# Altium project ZettBrettBoard.PrjPcb (part 1 of 2)
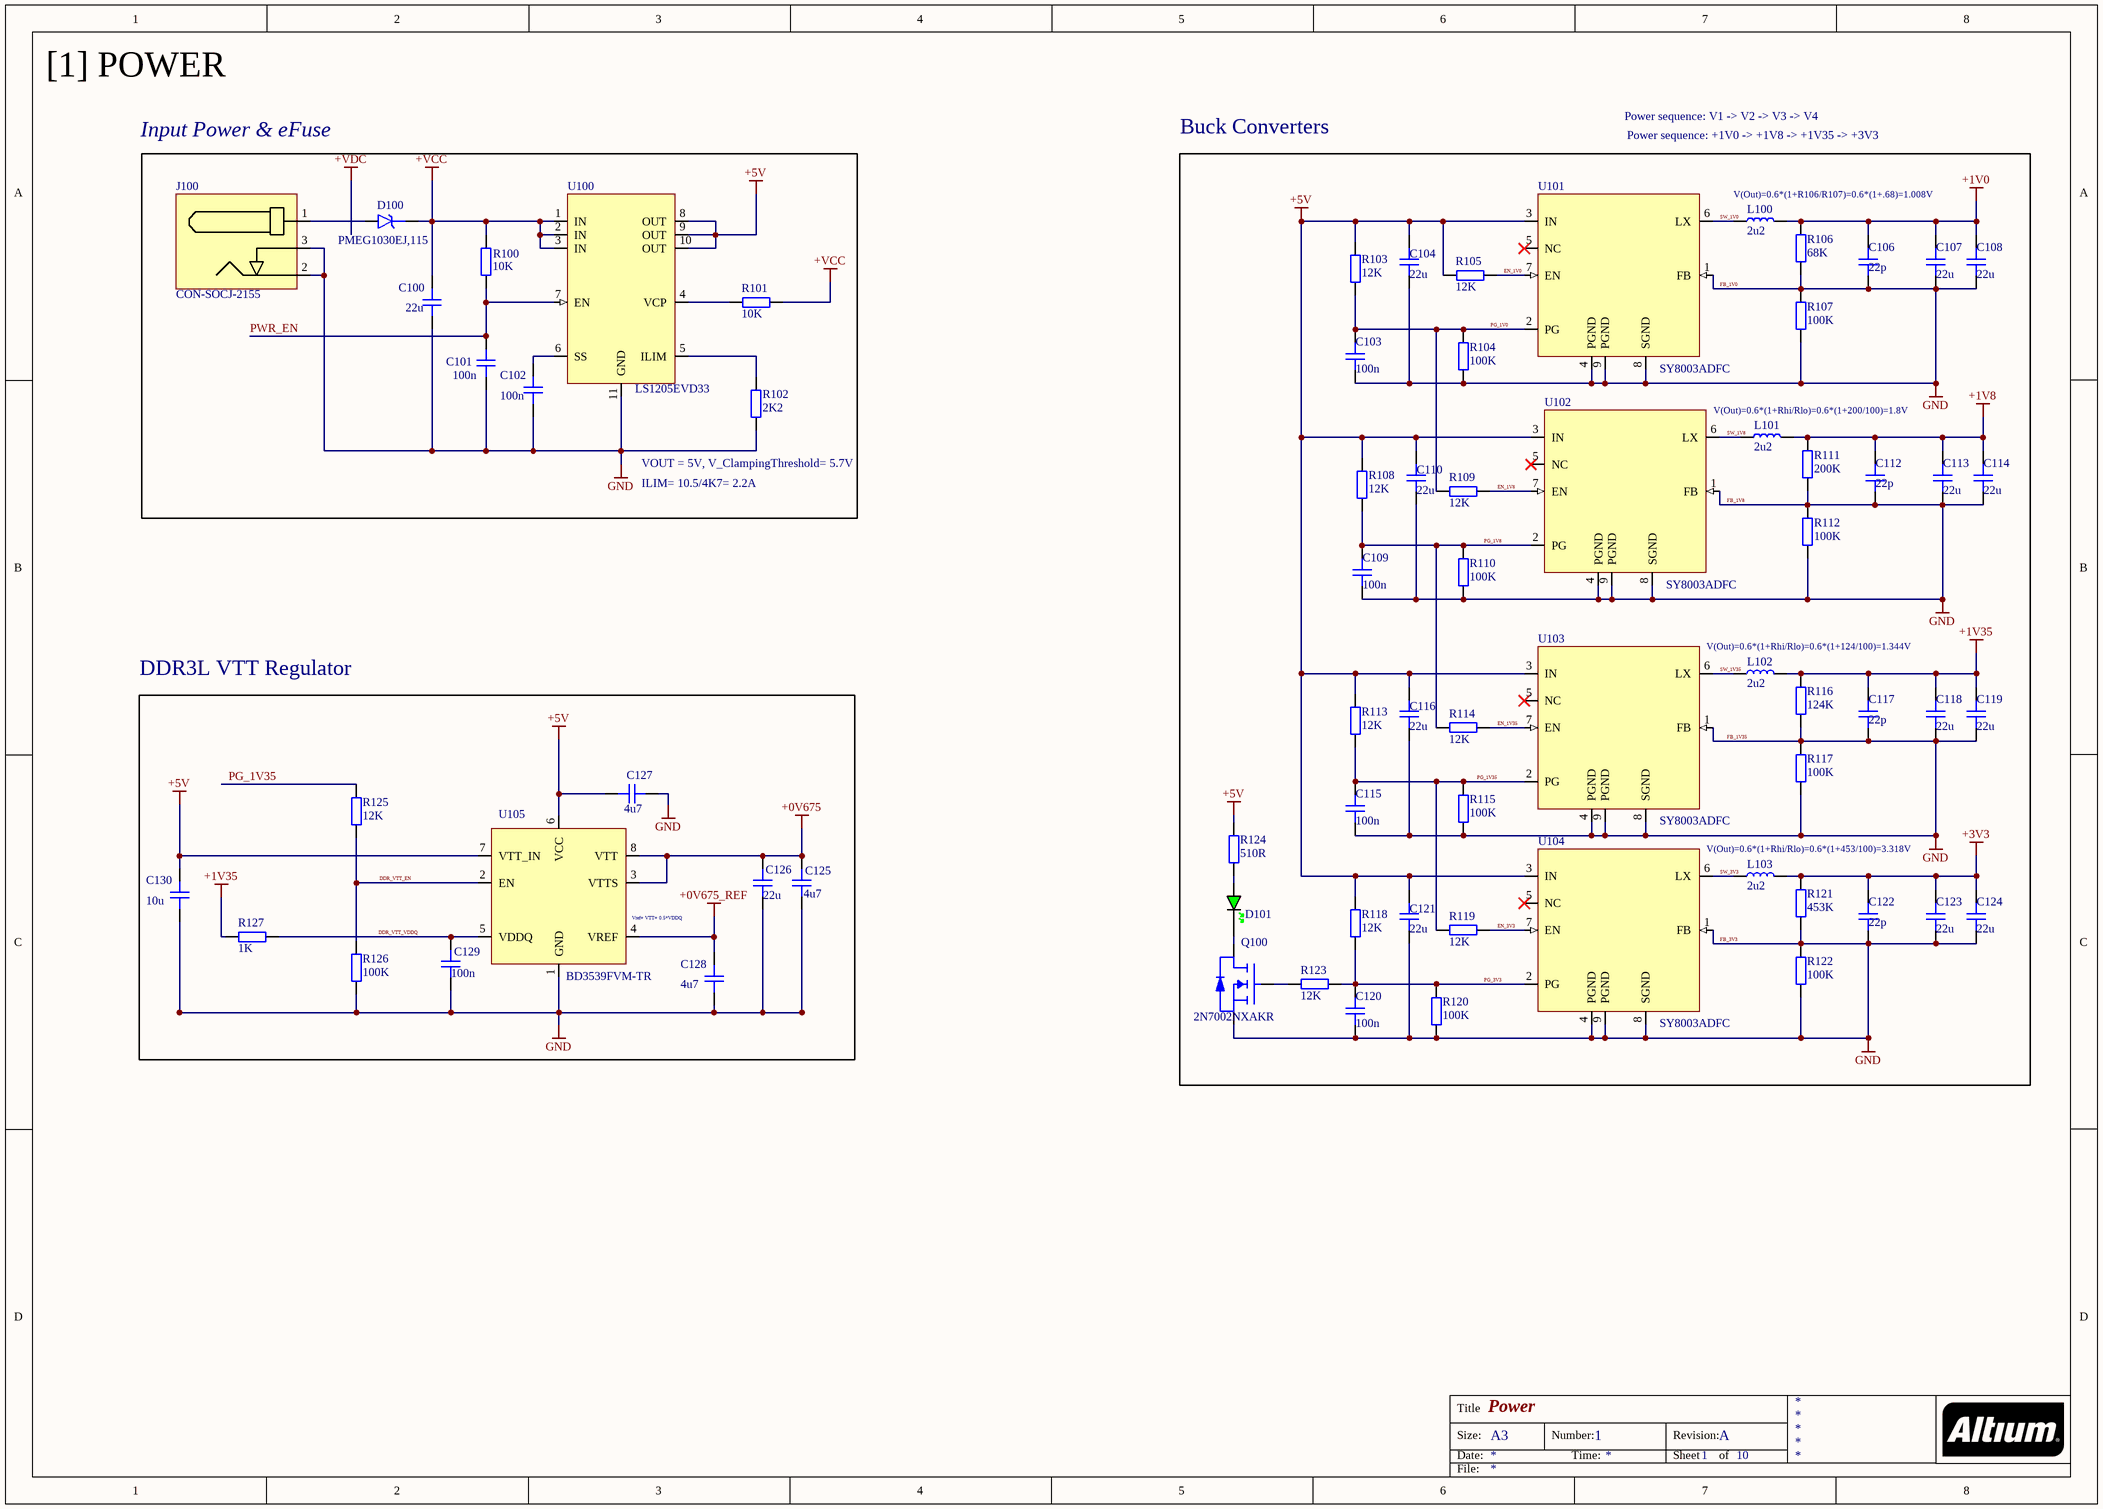
[diagram p0: Power.SchDoc]
10 sheets, 357 parts. Net scope: global (net labels, ports and power ports of the same name join across sheets).
Sheets:
  Power.SchDoc
  Zynq-Power.SchDoc
  Zynq Config - JTAG - Debug.SchDoc
  Zynq Processing System (PS).SchDoc
  Zynq DDR Interface & Termination.SchDoc
  Zynq Programmable Logic System (PL).SchDoc
  Gigabit Ethernet.SchDoc
  USB 2 High Speed (OTG).SchDoc
  DDR3L.SchDoc
  Mezzanine.SchDoc

## Sheet Power.SchDoc: Power
size A3; DocumentNumber: 1; Revision: A; SheetNumber: 1; SheetTotal: 10

### Parts
C100  22u  [CAP_1210]
C101  100n  [CAP_1210]
C102  100n  [CAP_1210]
C103  100n  [CAP_1210]
C104  22u  [CAP_1210]
C106  22p  [CAP_1210]
C107  22u  [CAP_1210]
C108  22u  [CAP_1210]
C109  100n  [CAP_1210]
C110  22u  [CAP_1210]
C112  22p  [CAP_1210]
C113  22u  [CAP_1210]
C114  22u  [CAP_1210]
C115  100n  [CAP_1210]
C116  22u  [CAP_1210]
C117  22p  [CAP_1210]
C118  22u  [CAP_1210]
C119  22u  [CAP_1210]
C120  100n  [CAP_1210]
C121  22u  [CAP_1210]
C122  22p  [CAP_1210]
C123  22u  [CAP_1210]
C124  22u  [CAP_1210]
C125  4u7  [CAP_1210]
C126  22u  [CAP_1210]
C127  4u7  [CAP_1210]
C128  4u7  [CAP_1210]
C129  100n  [CAP_1210]
C130  10u  [CAP_1210]
D100  PMEG1030EJ,115  [SOD-323]
D101  GREEN  [LED_0402_GREEN]  (value not drawn)
J100  CON-SOCJ-2155  [CON-SOCJ-2155]
L100  2u2  [NRS5020]
L101  2u2  [NRS5020]
L102  2u2  [NRS5020]
L103  2u2  [NRS5020]
Q100  2N7002NXAKR  [SSM3J338R,LF-SOT23-F]
R100  10K  [RES_0402]
R101  10K  [RES_0402]
R102  2K2  [RES_0402]
R103  12K  [RES_0402]
R104  100K  [RES_0402]
R105  12K  [RES_0402]
R106  68K  [RES_0402]
R107  100K  [RES_0402]
R108  12K  [RES_0402]
R109  12K  [RES_0402]
R110  100K  [RES_0402]
R111  200K  [RES_0402]
R112  100K  [RES_0402]
R113  12K  [RES_0402]
R114  12K  [RES_0402]
R115  100K  [RES_0402]
R116  124K  [RES_0402]
R117  100K  [RES_0402]
R118  12K  [RES_0402]
R119  12K  [RES_0402]
R120  100K  [RES_0402]
R121  453K  [RES_0402]
R122  100K  [RES_0402]
R123  12K  [RES_0402]
R124  510R  [RES_0402]
R125  12K  [RES_0402]
R126  100K  [RES_0402]
R127  1K  [RES_0402]
U100  LS1205EVD33  [DFN3x3_10L]
U101  SY8003ADFC  [DFN2x2-8]
U102  SY8003ADFC  [DFN2x2-8]
U103  SY8003ADFC  [DFN2x2-8]
U104  SY8003ADFC  [DFN2x2-8]
U105  BD3539FVM-TR  [MSOP8]

### Blocks framed on the sheet
Input Power & eFuse: C100-C102 D100 J100 R100-R102 U100
Buck Converters: C103 C104 C106-C110 C112-C124 D101 L100-L103 Q100 R103-R124 U101-U104
DDR3L VTT Regulator: C125-C130 R125-R127 U105

### Nets
+0V675: C125.2 C126.2 U105.3(VTTS) U105.8(VTT)
+0V675_REF: C128.2 U105.4(VREF)
+1V0: C106.2 C107.2 C108.2 L100.2 R106.1
+1V8: C112.2 C113.2 C114.2 L101.2 R111.1
+1V35: C117.2 C118.2 C119.2 L102.2 R116.1 R127.1
+3V3: C122.2 C123.2 C124.2 L103.2 R121.1
+5V: C104.2 C110.2 C116.2 C121.2 C127.2 C130.2 R103.1 R105.1 R108.1 R113.1 R118.1 R124.2 U100.8(OUT) U100.9(OUT) U100.10(OUT) U101.3(IN) U102.3(IN) U103.3(IN) U104.3(IN) U105.6(VCC) U105.7(VTT_IN)
+VCC: C100.2 D100.K R100.2 R101.1 U100.1(IN) U100.2(IN) U100.3(IN)
FB_1V0: C100.1 C101.1 C102.1 C103.1 C104.1 C106.1 C107.1 C108.1 C109.1 C110.1 C112.1 C113.1 C114.1 C115.1 C116.1 C117.1 C118.1 C119.1 C120.1 C121.1 C122.1 C123.1 C124.1 C125.1 C126.1 C127.1 C128.1 C129.1 C130.1 J100.2 J100.3 Q100.S R102.2 R104.2 R106.2 R107.1 R107.2 R110.2 R111.2 R112.1 R112.2 R115.2 R116.2 R117.1 R117.2 R120.2 R121.2 R122.1 R122.2 R126.2 U100.11(GND) U101.1(FB) U101.4(PGND) U101.8(SGND) U101.9(PGND) U102.1(FB) U102.4(PGND) U102.8(SGND) U102.9(PGND) U103.1(FB) U103.4(PGND) U103.8(SGND) U103.9(PGND) U104.1(FB) U104.4(PGND) U104.8(SGND) U104.9(PGND) U105.1(GND)  [also labelled FB_1V35, FB_1V8, FB_3V3, GND]
DDR_VTT_EN: R125.2 R126.1 U105.2(EN)
DDR_VTT_VDDQ: C129.2 R127.2 U105.5(VDDQ)
EN_1V0: R105.2 U101.7(EN)
EN_1V8: R109.2 U102.7(EN)
EN_1V35: R114.2 U103.7(EN)
EN_3V3: R119.2 U104.7(EN)
PG_1V0: C103.2 R103.2 R104.1 R109.1 U101.2(PG)
PG_1V8: C109.2 R108.2 R110.1 R114.1 U102.2(PG)
PG_1V35: C115.2 R113.2 R115.1 R119.1 R125.1 U103.2(PG)
PG_3V3: C120.2 R118.2 R120.1 R123.2 U104.2(PG)
PWR_EN: C101.2 R100.1 U100.7(EN)
SW_1V0: L100.1 U101.6(LX)
SW_1V8: L101.1 U102.6(LX)
SW_1V35: L102.1 U103.6(LX)
SW_3V3: L103.1 U104.6(LX)
NetC102_2: C102.2 U100.6(SS)
NetD100_A: D100.A J100.1
NetD101_A: D101.A R124.1
NetD101_K: D101.K Q100.D
NetQ100_G: Q100.G R123.1
NetR101_2: R101.2 U100.4(VCP)
NetR102_1: R102.1 U100.5(ILIM)

Not connected (* = marked no-connect by the designer): U101 5(NC)*; U102 5(NC)*; U103 5(NC)*; U104 5(NC)*

### Notes on the sheet
- [1] POWER
- Power sequence: V1 -> V2 -> V3 -> V4
- Power sequence: +1V0 -> +1V8 -> +1V35 -> +3V3
- V(Out)=0.6*(1+R106/R107)=0.6*(1+.68)=1.008V
- V(Out)=0.6*(1+Rhi/Rlo)=0.6*(1+200/100)=1.8V
- ILIM= 10.5/4K7= 2.2A
- (near R102) VOUT = 5V, V_ClampingThreshold= 5.7V
- V(Out)=0.6*(1+Rhi/Rlo)=0.6*(1+124/100)=1.344V
- V(Out)=0.6*(1+Rhi/Rlo)=0.6*(1+453/100)=3.318V
- (near U105) Vref= VTT= 0.5*VDDQ
- Title
- Size:
- Date:
- A3
- Number:
- Time:
- Revision:
- Sheet
- of
- File:

### Library data of the parts
C100-C104 C106-C110 C112-C130 = CAP_1210: Capacitor SMD 1210; Manufacturer: *; Manufacturer Part Number: *; Distributor Link: *; LCSC: *; Rating: *; Dielectric: *
D100 = D_ZENER_SOD_323: Diode Zener SMD SOD-323
D101 = LED_0402_GREEN: LED 0402 GREEN SMD
J100 = CON-SOCJ-2155: DC Barrell Jack 2.1mm 30V 2.5A THT; Manufacturer: Gravitech; Manufacturer Part Number: CON-SOCJ-2155
L100-L103 = NRS5020: NRS5020 SMD Power Inductor Taiyo Yuden; Manufacturer: Taiyo Yuden; Manufacturer Part Number: NRS5020
Q100 = 2N7002NXAKR: MOSFET N-Channel Vds=60V Id=300mA with ESD Protection; Manufacturer: Nexperia; Manufacturer Part Number: 2N7002NXAKR
R100-R127 = RES_0402: Resistor SMD 0402; Manufacturer: *; Manufacturer Part Number: *; Distributor Link: *; LCSC: *
U100 = LS1205EVD33: 18V, 5A eFuse with Programmable Current Limit and Output Voltage Clamp; Manufacturer: Littelfuse; Manufacturer Part Number: LS1205EVD33
U101-U104 = SY8003ADFC: High Efficiency 5.5V, 3A Continuous, 1MHz Synchronous Step Down Regulator; Manufacturer: Silergy; Manufacturer Part Number: High Efficiency 5.5V, 3A continuous, 1MHz; LCSC: C178236
U105 = BD3539FVM-TR: 1.0V to 5.5V, 1A 1Ch Termination Regulator for DDR-SDRAMs; Manufacturer: ROHM Semiconductor; Manufacturer Part Number: BD3539FVM-TR

## Sheet Zynq-Power.SchDoc: Zynq-Power
size A4; DrawnBy: Omar Moussa; Engineer: Omar Moussa; DocumentNumber: 2; Revision: A; SheetNumber: 2; SheetTotal: 10
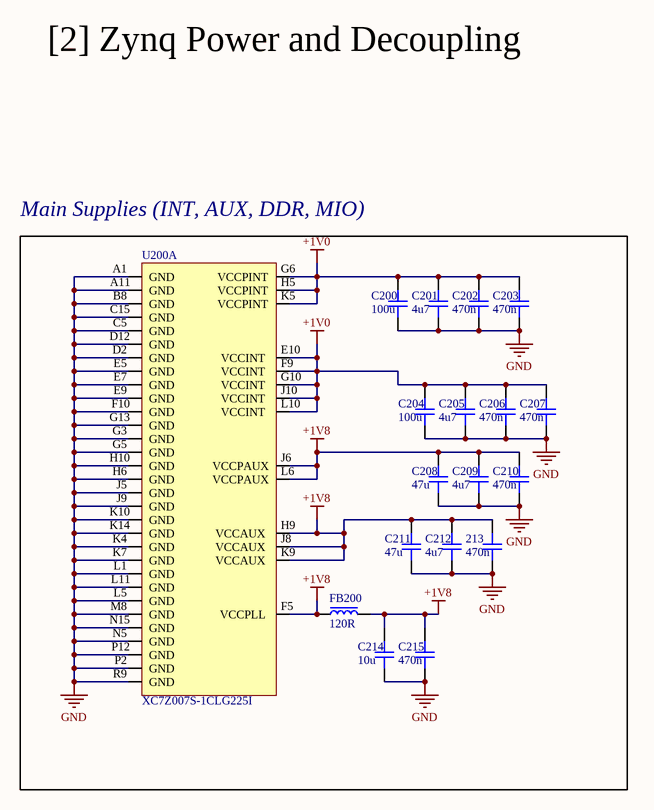
[diagram p1: Zynq-Power.SchDoc]

### Parts
213  470n  [CAP_1210]
C200  100u  [CAP_1210]
C201  4u7  [CAP_1210]
C202  470n  [CAP_1210]
C203  470n  [CAP_1210]
C204  100u  [CAP_1210]
C205  4u7  [CAP_1210]
C206  470n  [CAP_1210]
C207  470n  [CAP_1210]
C208  47u  [CAP_1210]
C209  4u7  [CAP_1210]
C210  470n  [CAP_1210]
C211  47u  [CAP_1210]
C212  4u7  [CAP_1210]
C214  10u  [CAP_1210]
C215  470n  [CAP_1210]
FB200  120R  [FB_0402]
U200  XC7Z007S-1CLG225I  [CLG225]  (part A of 7)

### Blocks framed on the sheet
Main Supplies (INT, AUX, DDR, MIO): 213 C200-C212 C214 C215 FB200 U200

### Nets
+1V0: C200.2 C201.2 C202.2 C203.2 C204.2 C205.2 C206.2 C207.2 U200.E10(VCCINT) U200.F9(VCCINT) U200.G6(VCCPINT) U200.G10(VCCINT) U200.H5(VCCPINT) U200.J10(VCCINT) U200.K5(VCCPINT) U200.L10(VCCINT)
+1V8: 213.2 C208.2 C209.2 C210.2 C211.2 C212.2 C214.2 C215.2 FB200.1 FB200.2 U200.F5(VCCPLL) U200.H9(VCCAUX) U200.J6(VCCPAUX) U200.J8(VCCAUX) U200.K9(VCCAUX) U200.L6(VCCPAUX)
GND: 213.1 C200.1 C201.1 C202.1 C203.1 C204.1 C205.1 C206.1 C207.1 C208.1 C209.1 C210.1 C211.1 C212.1 C214.1 C215.1 U200.A1(GND) U200.A11(GND) U200.B8(GND) U200.C5(GND) U200.C15(GND) U200.D2(GND) U200.D12(GND) U200.E5(GND) U200.E7(GND) U200.E9(GND) U200.F10(GND) U200.G3(GND) U200.G5(GND) U200.G13(GND) U200.H6(GND) U200.H10(GND) U200.J5(GND) U200.J9(GND) U200.K4(GND) U200.K7(GND) U200.K10(GND) U200.K14(GND) U200.L1(GND) U200.L5(GND) U200.L11(GND) U200.M8(GND) U200.N5(GND) U200.N15(GND) U200.P2(GND) U200.P12(GND) U200.R9(GND)  [project net FB_1V0]

### Notes on the sheet
- [2] Zynq Power and Decoupling
- Title
- Size:
- Date:
- A4
- Number:
- Time:
- Revision:
- Sheet
- of
- File:

### Library data of the parts
213 C200-C212 C214 C215 = CAP_1210: Capacitor SMD 1210; Manufacturer: *; Manufacturer Part Number: *; Distributor Link: *; LCSC: *; Rating: *; Dielectric: *
FB200 = FB_0402: Ferrite Bead SMD 0402; Manufacturer: *; Manufacturer Part Number: *; Distributor Link: *; LCSC: *
U200 = XC7Z007S-1CLG225I: Xilinx FPGA SoC Zynq 7-Series XC7Z007S CLG255 Package Industrial Temperature Grade; Manufacturer: Xilinx; Manufacturer Part Number: XC7Z007S-1CLG225I

## Sheet Zynq Config - JTAG - Debug.SchDoc: Zynq (Config, JTAG, Debug)
size A2; DocumentNumber: 3; Revision: A; SheetNumber: 3; SheetTotal: 10
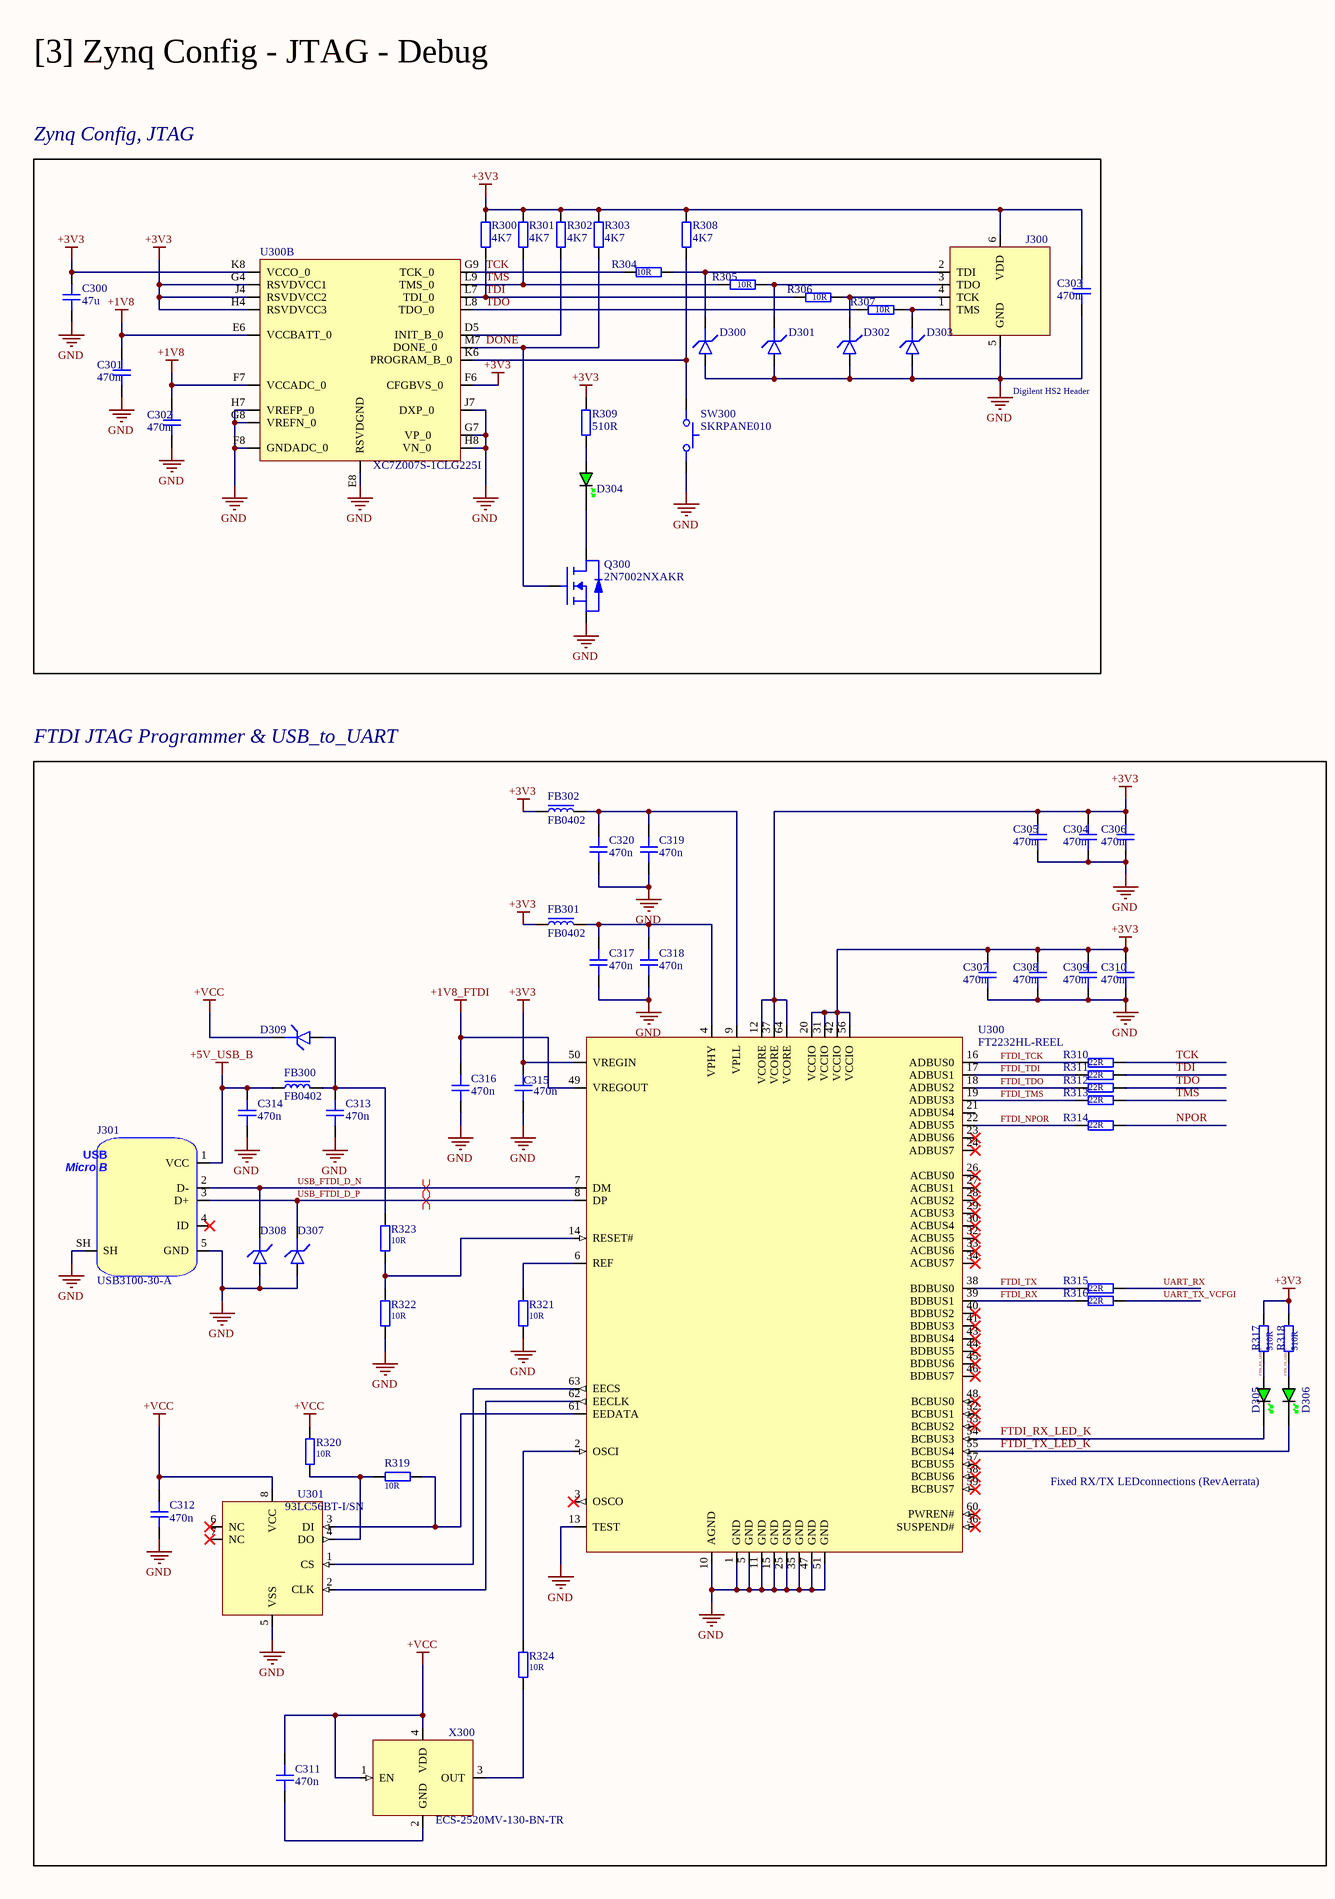
[diagram p2: Zynq Config - JTAG - Debug.SchDoc, left]
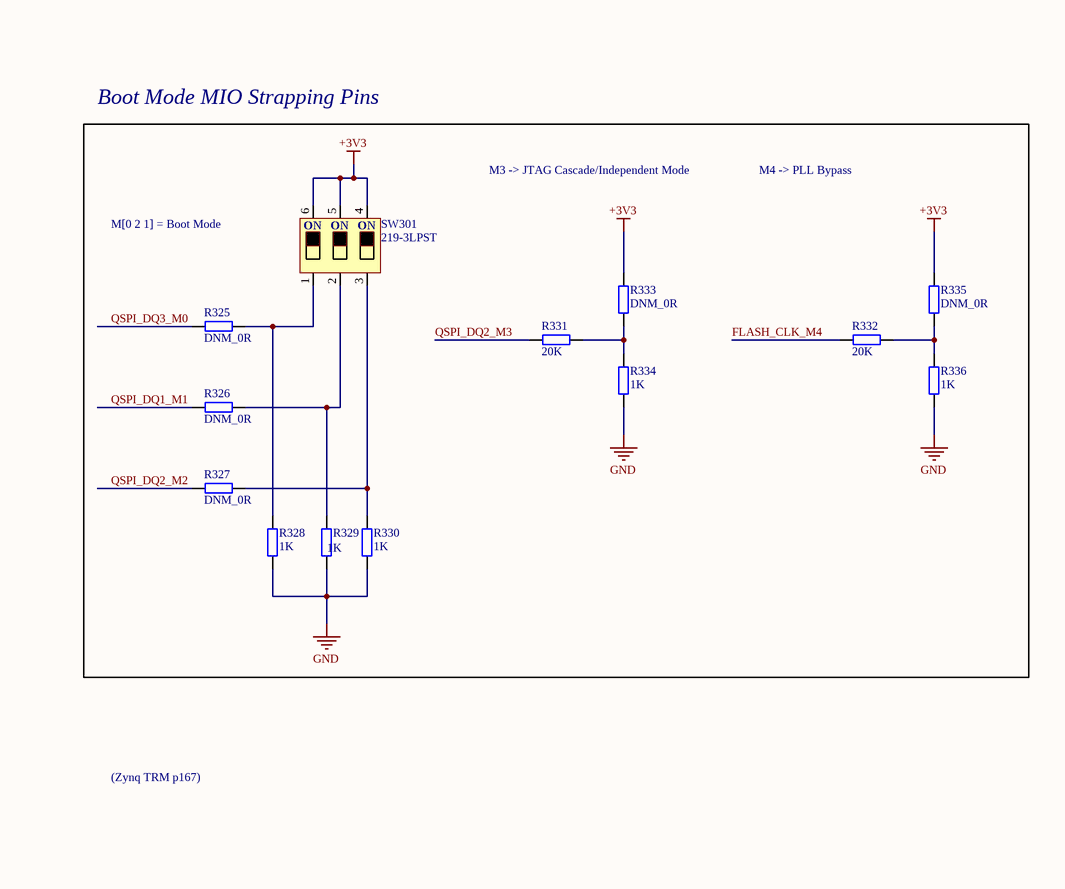
[diagram p3: Zynq Config - JTAG - Debug.SchDoc, right]

### Parts
(Parts that share a designator on the sheet are numbered #1, #2 ... from top to bottom, then left to right.)
C300  47u  [CAP_1210]
C301  470n  [CAP_1210]
C302  470n  [CAP_1210]
C303  470n  [CAP_1210]
C304  470n  [CAP_1210]
C305  470n  [CAP_1210]
C306  470n  [CAP_1210]
C307  470n  [CAP_1210]
C308  470n  [CAP_1210]
C309  470n  [CAP_1210]
C310  470n  [CAP_1210]
C311  470n  [CAP_1210]
C312  470n  [CAP_1210]
C313  470n  [CAP_1210]
C314  470n  [CAP_1210]
C315  470n  [CAP_1210]
C316  470n  [CAP_1210]
C317  470n  [CAP_1210]
C318  470n  [CAP_1210]
C319  470n  [CAP_1210]
C320  470n  [CAP_1210]
D300  D_TVS_0402  [D_0402]  (value not drawn)
D301  D_TVS_0402  [D_0402]  (value not drawn)
D302  D_TVS_0402  [D_0402]  (value not drawn)
D303  D_TVS_0402  [D_0402]  (value not drawn)
D304  GREEN  [LED_0402_GREEN]  (value not drawn)
D305  GREEN  [LED_0402_GREEN]  (value not drawn)
D306  GREEN  [LED_0402_GREEN]  (value not drawn)
D307  D_TVS_0402  [D_0402]  (value not drawn)
D308  D_TVS_0402  [D_0402]  (value not drawn)
D309  D_TVS_0402  [D_0402]  (value not drawn)
FB300  FB0402  [FB_0402]
FB301  FB0402  [FB_0402]
FB302  FB0402  [FB_0402]
J300  Digilent HS2 Header  [DIGILENT_HS2]
J301  USB3100-30-A  [USB3100-30-A]
Q300  2N7002NXAKR  [SSM3J338R,LF-SOT23-F]
R300  4K7  [RES_0402]
R301  4K7  [RES_0402]
R302  4K7  [RES_0402]
R303  4K7  [RES_0402]
R304  10R  [RES_0402]
R305  10R  [RES_0402]
R306  10R  [RES_0402]
R307  10R  [RES_0402]
R308  4K7  [RES_0402]
R309  510R  [RES_0402]
R310  22R  [RES_0402]
R311  22R  [RES_0402]
R312  22R  [RES_0402]
R313  22R  [RES_0402]
R314  22R  [RES_0402]
R315  22R  [RES_0402]
R316  22R  [RES_0402]
R317  510R  [RES_0402]
R318  510R  [RES_0402]
R319  10R  [RES_0402]
R320  10R  [RES_0402]
R321  10R  [RES_0402]
R322  10R  [RES_0402]
R323  10R  [RES_0402]
R324  10R  [RES_0402]
R325  DNM_0R  [RES_0402]
R326  DNM_0R  [RES_0402]
R327  DNM_0R  [RES_0402]
R328  1K  [RES_0402]
R329  1K  [RES_0402]
R330  1K  [RES_0402]
R331  20K  [RES_0402]
R332  20K  [RES_0402]
R333  DNM_0R  [RES_0402]
R334  1K  [RES_0402]
R335  DNM_0R  [RES_0402]
R336  1K  [RES_0402]
SW300  SKRPANE010  [SKRPANE010]
SW301  219-3LPST  [219-3LPST]
U300#1  XC7Z007S-1CLG225I  [CLG225]  (part B of 7)
U300#2  FT2232HL-REEL  [LQFP-64-0.5mm]
U301  93LC56BT-I/SN  [SOIC-8]
X300  ECS-2520MV-130-BN-TR  [XTAL_2520]

### Blocks framed on the sheet
Zynq Config, JTAG: C300-C303 D300-D304 J300 Q300 R300-R309 SW300 U300#1
Boot Mode MIO Strapping Pins: R325-R336 SW301
FTDI JTAG Programmer & USB_to_UART: C304-C320 D305-D309 FB300-FB302 J301 R310-R324 U300#2 U301 X300

### Nets
+1V8: C301.2 C302.2 U300#1.E6(VCCBATT_0) U300#1.F7(VCCADC_0)
+1V8_FTDI: C316.2 U300#2.49(VREGOUT)
+3V3: C300.2 C303.2 C304.2 C305.2 C306.2 C307.2 C308.2 C309.2 C310.2 C315.2 FB301.1 FB302.1 J300.6(VDD) R300.2 R301.2 R302.2 R303.2 R308.2 R309.1 R317.1 R318.1 R333.1 R335.1 SW301.4 SW301.5 SW301.6 U300#1.F6(CFGBVS_0) U300#1.G4(RSVDVCC1) U300#1.H4(RSVDVCC3) U300#1.J4(RSVDVCC2) U300#1.K8(VCCO_0) U300#2.12(VCORE) U300#2.20(VCCIO) U300#2.31(VCCIO) U300#2.37(VCORE) U300#2.42(VCCIO) U300#2.50(VREGIN) U300#2.56(VCCIO) U300#2.64(VCORE)
+5V_USB_B: C314.2 FB300.1 J301.1(VCC)
+VCC: C311.2 C312.2 D309.K R320.1 U301.8(VCC) X300.1(EN) X300.4(VDD)
GND: C300.1 C301.1 C302.1 C303.1 C304.1 C305.1 C306.1 C307.1 C308.1 C309.1 C310.1 C312.1 C313.1 C314.1 C315.1 C316.1 C317.1 C318.1 C319.1 C320.1 D300.A D301.A D302.A D303.A D307.A D308.A J300.5(GND) J301.5(GND) J301.SH Q300.S R321.2 R322.2 R328.2 R329.1 R330.1 R334.2 R336.2 SW300.34 U300#1.E8(RSVDGND) U300#1.F8(GNDADC_0) U300#1.G7(VP_0) U300#1.G8(VREFN_0) U300#1.H7(VREFP_0) U300#1.H8(VN_0) U300#1.J7(DXP_0) U300#2.1(GND) U300#2.5(GND) U300#2.10(AGND) U300#2.11(GND) U300#2.13(TEST) U300#2.15(GND) U300#2.25(GND) U300#2.35(GND) U300#2.47(GND) U300#2.51(GND) U301.5(VSS)  [project net FB_1V0]
DONE: Q300.G R303.1 U300#1.M7(DONE_0)
FLASH_CLK_M4: R332.2
FTDI_NPOR: R314.2 U300#2.22(ADBUS5)
FTDI_RX: R316.2 U300#2.39(BDBUS1)
FTDI_RX_LED_A: D305.A R317.2
FTDI_RX_LED_K: D305.K U300#2.54(BCBUS3)
FTDI_TCK: R310.2 U300#2.16(ADBUS0)
FTDI_TDI: R311.2 U300#2.17(ADBUS1)
FTDI_TDO: R312.2 U300#2.18(ADBUS2)
FTDI_TMS: R313.2 U300#2.19(ADBUS3)
FTDI_TX: R315.2 U300#2.38(BDBUS0)
FTDI_TX_LED_A: D306.A R318.2
FTDI_TX_LED_K: D306.K U300#2.55(BCBUS4)
NPOR: R314.1
QSPI_DQ1_M1: R326.2
QSPI_DQ2_M2: R327.2
QSPI_DQ2_M3: R331.2
QSPI_DQ3_M0: R325.2
TCK: R300.1 R301.1 R304.2 R305.2 R306.2 R310.1 R311.1 R313.1 U300#1.G9(TCK_0) U300#1.L7(TDI_0) U300#1.L9(TMS_0)  [also labelled TDI, TMS]
TDO: R307.2 R312.1 U300#1.L8(TDO_0)
UART_RX: R315.1
UART_TX_VCFGI: R316.1
USB_FTDI_D_N: D308.K J301.2(D-) U300#2.7(DM)
USB_FTDI_D_P: D307.K J301.3(D+) U300#2.8(DP)
NetC311_1: C311.1 X300.2(GND)
NetC313_2: C313.2 D309.A FB300.2 R323.1
NetC317_2: C317.2 C318.2 FB301.2 U300#2.4(VPHY)
NetC319_2: C319.2 C320.2 FB302.2 U300#2.9(VPLL)
NetD300_K: D300.K J300.2(TDI) R304.1
NetD301_K: D301.K J300.3(TDO) R305.1
NetD302_K: D302.K J300.4(TCK) R306.1
NetD303_K: D303.K J300.1(TMS) R307.1
NetD304_A: D304.A R309.2
NetD304_K: D304.K Q300.D
NetR302_1: R302.1 U300#1.D5(INIT_B_0)
NetR308_1: R308.1 SW300.12 U300#1.K6(PROGRAM_B_0)
NetR319_1: R319.1 R320.2 U301.4(DO)
NetR319_2: R319.2 U300#2.61(EEDATA) U301.3(DI)
NetR321_1: R321.1 U300#2.6(REF)
NetR322_1: R322.1 R323.2 U300#2.14(RESET#)
NetR324_1: R324.1 X300.3(OUT)
NetR324_2: R324.2 U300#2.2(OSCI)
NetR325_1: R325.1 R328.1 SW301.1
NetR326_1: R326.1 R329.2 SW301.2
NetR327_1: R327.1 R330.2 SW301.3
NetR331_1: R331.1 R333.2 R334.1
NetR332_1: R332.1 R335.2 R336.1
NetU300#2_62: U300#2.62(EECLK) U301.2(CLK)
NetU300#2_63: U300#2.63(EECS) U301.1(CS)

Not connected (* = marked no-connect by the designer): J301 4(ID)*; U300#2 3(OSCO)* 21(ADBUS4) 23(ADBUS6)* 24(ADBUS7)* 26(ACBUS0)* 27(ACBUS1)* 28(ACBUS2)* 29(ACBUS3)* 30(ACBUS4)* 32(ACBUS5)* 33(ACBUS6)* 34(ACBUS7)* 36(SUSPEND#)* 40(BDBUS2)* 41(BDBUS3)* 43(BDBUS4)* 44(BDBUS5)* 45(BDBUS6)* 46(BDBUS7)* 48(BCBUS0)* 52(BCBUS1)* 53(BCBUS2)* 57(BCBUS5)* 58(BCBUS6)* 59(BCBUS7)* 60(PWREN#)*; U301 6(NC)* 7(NC)*

### Layout directives
differential pair: USB_FTDI_D_N, USB_FTDI_D_P

### Notes on the sheet
- [3] Zynq Config - JTAG - Debug
- M3 -> JTAG Cascade/Independent Mode
- M4 -> PLL Bypass
- M[0 2 1] = Boot Mode
- (Zynq TRM p167)
- Fixed RX/TX LEDconnections (RevAerrata)
- Title
- Size:
- Date:
- File:
- A2
- Number:
- Time:
- Revision:
- Sheet
- of
- (in symbol 219-3LPST) ON
- (in symbol USB3100-30-A) USB; Micro B

### Library data of the parts
C300-C320 = CAP_1210: Capacitor SMD 1210; Manufacturer: *; Manufacturer Part Number: *; Distributor Link: *; LCSC: *; Rating: *; Dielectric: *
D300-D303 D307-D309 = D_TVS_0402: Diode TVS / ESD 0402
D304-D306 = LED_0402_GREEN: LED 0402 GREEN SMD
FB300-FB302 = FB_0402: Ferrite Bead SMD 0402; Manufacturer: *; Manufacturer Part Number: *; Distributor Link: *; LCSC: *
J300 = Digilent_HS2_Header: Digilent HS2 6-Pin 2.54mm Pitch Header; Manufacturer: Amphenol FCI; Manufacturer Part Number: 68000-406HLF
J301 = USB3100-30-A: USB Connector Type Micro B 2.0 SMD Reverse Mount; Manufacturer: GCT; Manufacturer Part Number: USB3100-30-A
Q300 = 2N7002NXAKR: as Q100 on sheet Power; Manufacturer Part Number: 2N7002NXAKR
R300-R336 = RES_0402: Resistor SMD 0402; Manufacturer: *; Manufacturer Part Number: *; Distributor Link: *; LCSC: *
SW300 = SKRPANE010: Tactile Switch SMD SPST; Manufacturer: Alps Alpine; Manufacturer Part Number: SKRPANE010
SW301 = 219-3LPST: DIP Switches SPST 3x; Manufacturer: CTS; Manufacturer Part Number: 219-3LPST
U300#1 = XC7Z007S-1CLG225I: as U200 on sheet Zynq-Power; Manufacturer: Xilinx; Manufacturer Part Number: XC7Z007S-1CLG225I
U300#2 = FT2232HL-REEL: Hi-Speed Dual USB UART/FIFO IC; Manufacturer: FTDI; Manufacturer Part Number: FT2232HL-REEL; Distributor Link: https://www.mouser.de/ProductDetail/FTDI/FT2232HL-REEL?qs=D1%2FPMqvA100v7FHcEx164g%3D%3D; LCSC: C27882
U301 = 93LC56BT-I/SN: 2K Microwire Compatible Serial EEPROM; Manufacturer: Microchip; Manufacturer Part Number: 93LC56BT-I/SN; Distributor Link: https://www.mouser.de/ProductDetail/Microchip-Technology/93LC56BT-I-SN?qs=lQv0JY93vreW%252BBssv4v8RA%3D%3D; LCSC: C6164
X300 = ECS-2520MV-130-BN-TR: Standard Clock Oscillators XO (Standard),13MHz,Standby (Power Down),CMOS, Multi-Volt,1.6 V 3.6 V,+/-50ppm,-40 C 85 C,6mA,Surface Mount,4-SMD, No Lead,(2.50mm x 2.00mm),(0.80mm); Manufacturer: ECS; Manufacturer Part Number: ECS-2520MV-130-BN-TR

## Sheet Zynq Processing System (PS).SchDoc: Zynq Procsessing System
size A3; DocumentNumber: 4; Revision: A; SheetNumber: 4; SheetTotal: 10
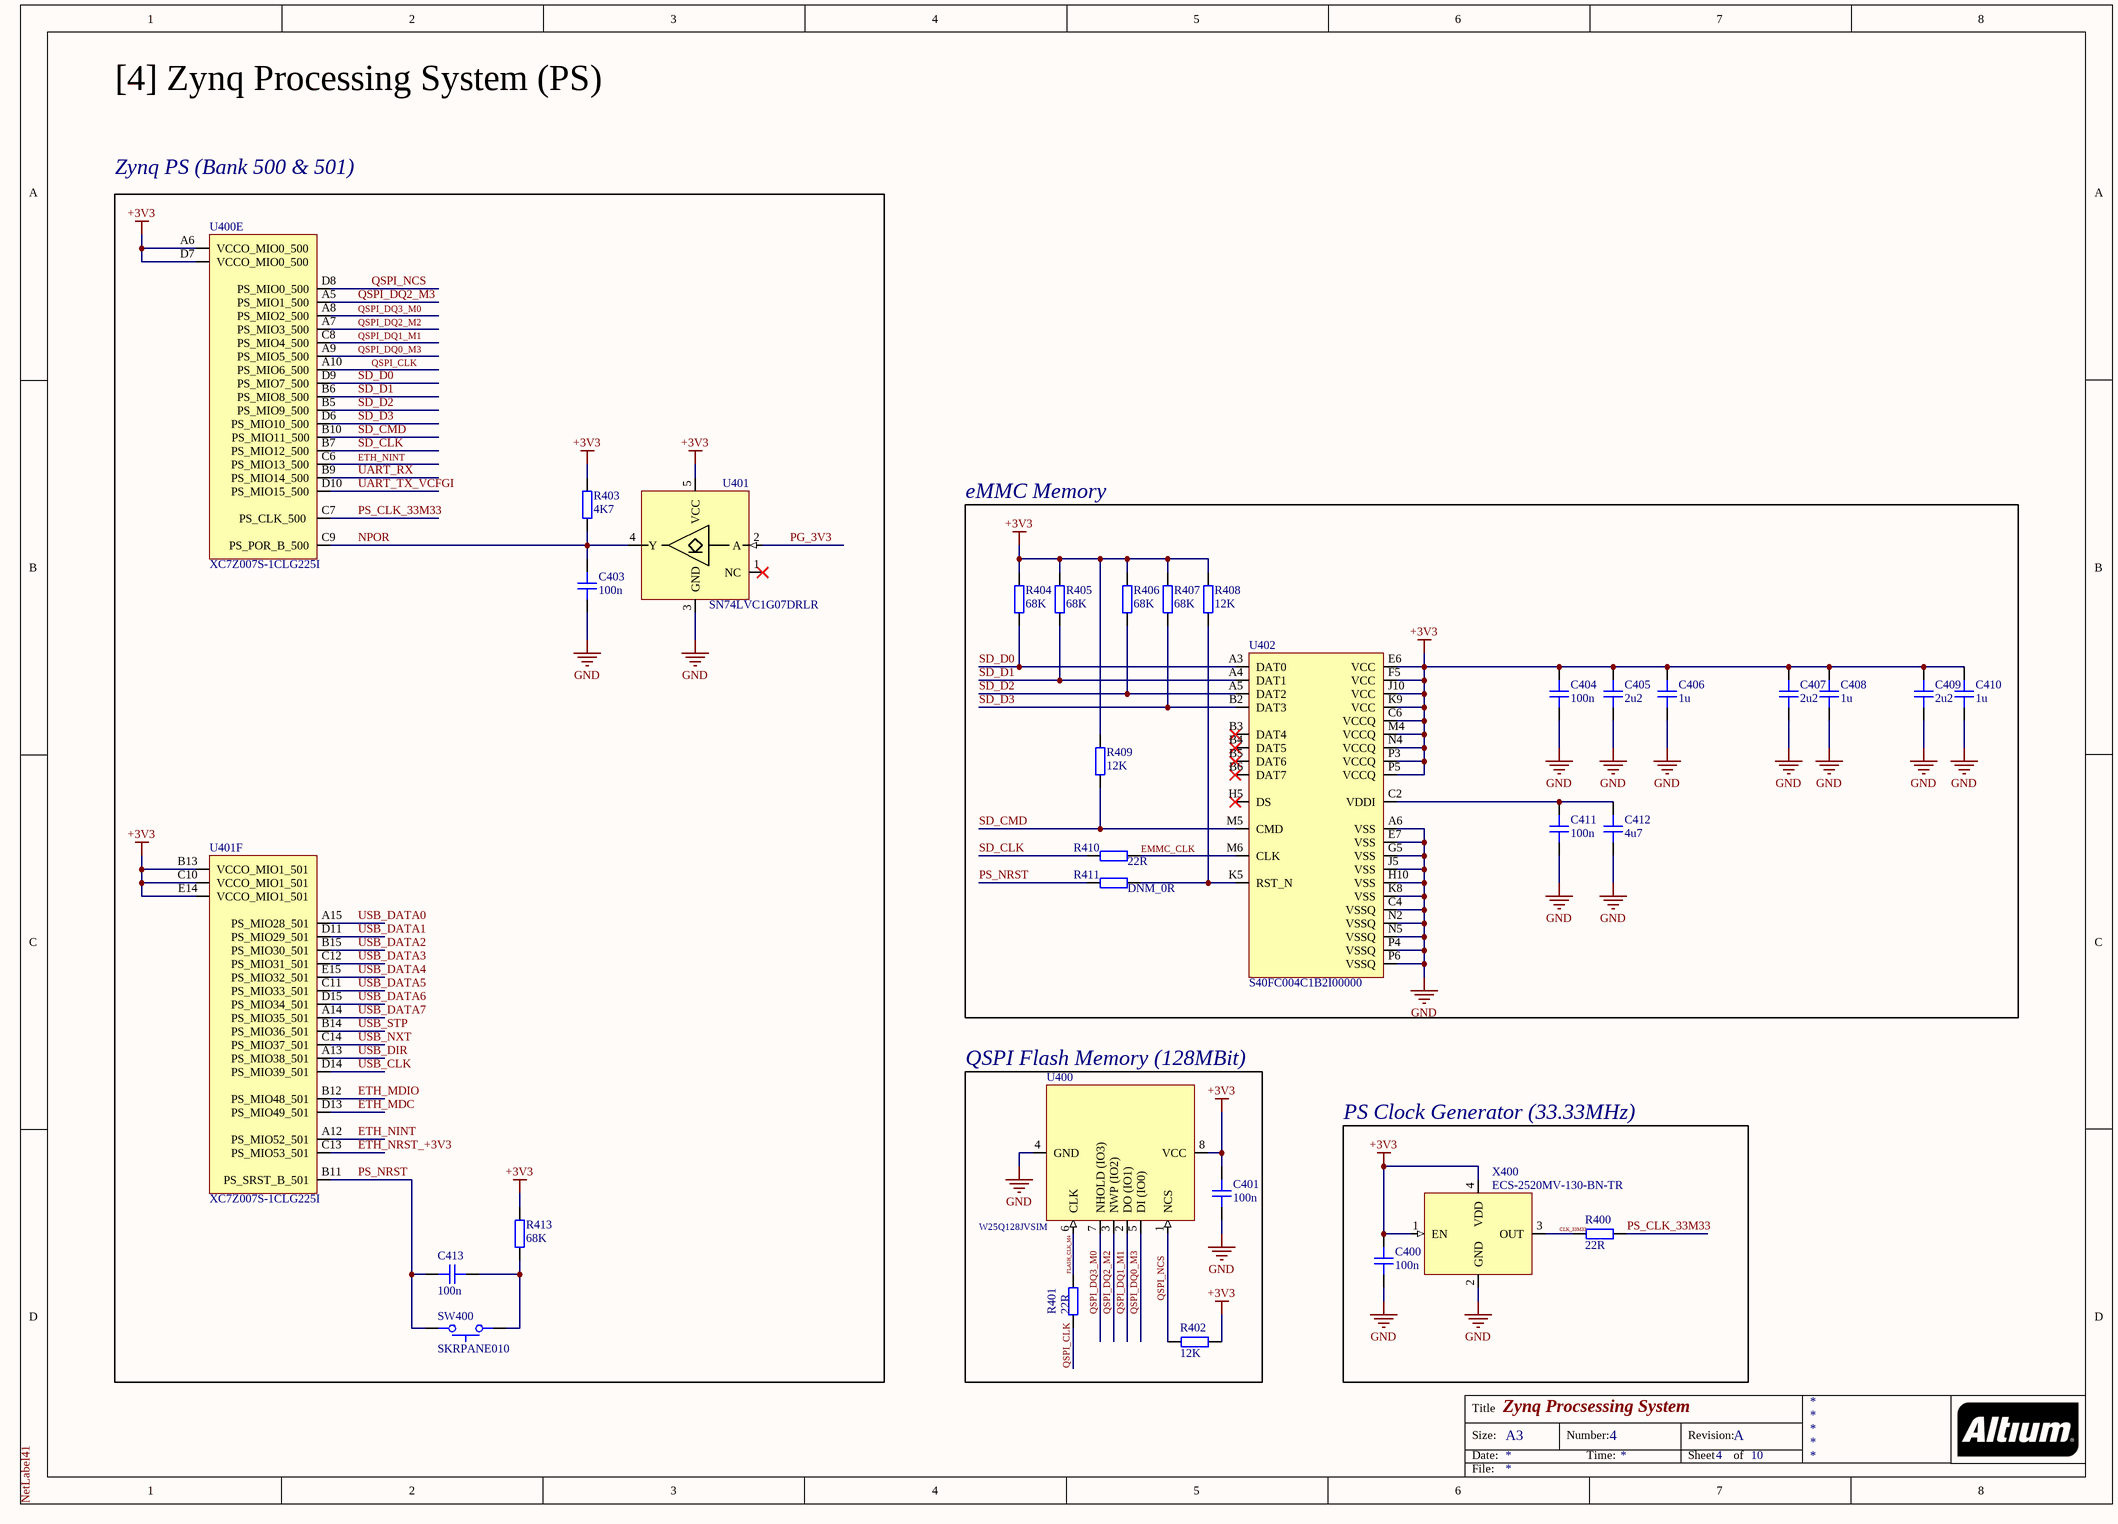
[diagram p4: Zynq Processing System (PS).SchDoc]

### Parts
(Parts that share a designator on the sheet are numbered #1, #2 ... from top to bottom, then left to right.)
C400  100n  [CAP_1210]
C401  100n  [CAP_1210]
C403  100n  [CAP_1210]
C404  100n  [CAP_1210]
C405  2u2  [CAP_1210]
C406  1u  [CAP_1210]
C407  2u2  [CAP_1210]
C408  1u  [CAP_1210]
C409  2u2  [CAP_1210]
C410  1u  [CAP_1210]
C411  100n  [CAP_1210]
C412  4u7  [CAP_1210]
C413  100n  [CAP_1210]
R400  22R  [RES_0402]
R401  22R  [RES_0402]
R402  12K  [RES_0402]
R403  4K7  [RES_0402]
R404  68K  [RES_0402]
R405  68K  [RES_0402]
R406  68K  [RES_0402]
R407  68K  [RES_0402]
R408  12K  [RES_0402]
R409  12K  [RES_0402]
R410  22R  [RES_0402]
R411  DNM_0R  [RES_0402]
R413  68K  [RES_0402]
SW400  SKRPANE010  [SKRPANE010]
U400#1  XC7Z007S-1CLG225I  [CLG225]  (part E of 7)
U400#2  W25Q128JVSIM  [SOIC-8]
U401#1  SN74LVC1G07DRLR  [SOT-5]
U401#2  XC7Z007S-1CLG225I  [CLG225]  (part F of 7)
U402  S40FC004C1B2I00000  [VFBGA153-9.0x7.5x0.8]
X400  ECS-2520MV-130-BN-TR  [XTAL_2520]

### Blocks framed on the sheet
Zynq PS (Bank 500 & 501): C403 C413 R403 R413 SW400 U400#1 U401#1 U401#2
eMMC Memory: C404-C412 R404-R411 U402
QSPI Flash Memory (128MBit): C401 R401 R402 U400#2
PS Clock Generator (33.33MHz): C400 R400 X400

### Nets
+3V3: C400.2 C401.2 C404.2 C405.2 C406.2 C407.2 C408.2 C409.2 C410.2 R402.1 R403.1 R404.1 R405.1 R406.1 R407.1 R408.1 R409.1 R413.2 U400#1.A6(VCCO_MIO0_500) U400#1.D7(VCCO_MIO0_500) U400#2.8(VCC) U401#1.5(VCC) U401#2.B13(VCCO_MIO1_501) U401#2.C10(VCCO_MIO1_501) U401#2.E14(VCCO_MIO1_501) U402.C6(VCCQ) U402.E6(VCC) U402.F5(VCC) U402.J10(VCC) U402.K9(VCC) U402.M4(VCCQ) U402.N4(VCCQ) U402.P3(VCCQ) U402.P5(VCCQ) X400.1(EN) X400.4(VDD)
GND: C400.1 C401.1 C403.1 C404.1 C405.1 C406.1 C407.1 C408.1 C409.1 C410.1 C411.1 C412.1 U400#2.4(GND) U401#1.3(GND) U402.A6(VSS) U402.C4(VSSQ) U402.E7(VSS) U402.G5(VSS) U402.H10(VSS) U402.J5(VSS) U402.K8(VSS) U402.N2(VSSQ) U402.N5(VSSQ) U402.P4(VSSQ) U402.P6(VSSQ) X400.2(GND)  [project net FB_1V0]
CLK_33M33: R400.1 X400.3(OUT)
EMMC_CLK: R410.2 U402.M6(CLK)
ETH_MDC: U401#2.D13(PS_MIO49_501)
ETH_MDIO: U401#2.B12(PS_MIO48_501)
ETH_NINT: U400#1.C6(PS_MIO13_500) U401#2.A12(PS_MIO52_501)
ETH_NRST_+3V3: U401#2.C13(PS_MIO53_501)
FLASH_CLK_M4: R401.2 U400#2.6(CLK)
NPOR: C403.2 R403.2 U400#1.C9(PS_POR_B_500) U401#1.4(Y)
PG_3V3: U401#1.2(A)
PS_CLK_33M33: R400.2 U400#1.C7(PS_CLK_500)
PS_NRST: C413.2 R411.1 SW400.34 U401#2.B11(PS_SRST_B_501)
QSPI_CLK: R401.1 U400#1.A10(PS_MIO6_500)
QSPI_DQ0_M3: U400#1.A9(PS_MIO5_500) U400#2.5(DI_(IO0))
QSPI_DQ1_M1: U400#1.C8(PS_MIO4_500) U400#2.2(DO_(IO1))
QSPI_DQ2_M2: U400#1.A7(PS_MIO3_500) U400#2.3(NWP_(IO2))
QSPI_DQ2_M3: U400#1.A5(PS_MIO1_500)
QSPI_DQ3_M0: U400#1.A8(PS_MIO2_500) U400#2.7(NHOLD_(IO3))
QSPI_NCS: R402.2 U400#1.D8(PS_MIO0_500) U400#2.1(NCS)
SD_CLK: R410.1 U400#1.B7(PS_MIO12_500)
SD_CMD: R409.2 U400#1.B10(PS_MIO11_500) U402.M5(CMD)
SD_D0: R404.2 U400#1.D9(PS_MIO7_500) U402.A3(DAT0)
SD_D1: R405.2 U400#1.B6(PS_MIO8_500) U402.A4(DAT1)
SD_D2: R406.2 U400#1.B5(PS_MIO9_500) U402.A5(DAT2)
SD_D3: R407.2 U400#1.D6(PS_MIO10_500) U402.B2(DAT3)
UART_RX: U400#1.B9(PS_MIO14_500)
UART_TX_VCFGI: U400#1.D10(PS_MIO15_500)
USB_CLK: U401#2.D14(PS_MIO39_501)
USB_DATA0: U401#2.A15(PS_MIO28_501)
USB_DATA1: U401#2.D11(PS_MIO29_501)
USB_DATA2: U401#2.B15(PS_MIO30_501)
USB_DATA3: U401#2.C12(PS_MIO31_501)
USB_DATA4: U401#2.E15(PS_MIO32_501)
USB_DATA5: U401#2.C11(PS_MIO33_501)
USB_DATA6: U401#2.D15(PS_MIO34_501)
USB_DATA7: U401#2.A14(PS_MIO35_501)
USB_DIR: U401#2.A13(PS_MIO38_501)
USB_NXT: U401#2.C14(PS_MIO37_501)
USB_STP: U401#2.B14(PS_MIO36_501)
NetC411_2: C411.2 C412.2 U402.C2(VDDI)
NetC413_1: C413.1 R413.1 SW400.12
NetR408_2: R408.2 R411.2 U402.K5(RST_N)

Not connected (* = marked no-connect by the designer): U401#1 1(NC)*; U402 B3(DAT4)* B4(DAT5)* B5(DAT6)* B6(DAT7)* H5(DS)*

### Notes on the sheet
- [4] Zynq Processing System (PS)
- Labels drawn without touching a wire or pin: NetLabel41
- Title
- Size:
- Date:
- A3
- Number:
- Time:
- Revision:
- Sheet
- of
- File:

### Library data of the parts
C400 C401 C403-C413 = CAP_1210: Capacitor SMD 1210; Manufacturer: *; Manufacturer Part Number: *; Distributor Link: *; LCSC: *; Rating: *; Dielectric: *
R400-R411 R413 = RES_0402: Resistor SMD 0402; Manufacturer: *; Manufacturer Part Number: *; Distributor Link: *; LCSC: *
SW400 = SKRPANE010: as SW300 on sheet Zynq Config - JTAG - Debug; Manufacturer Part Number: SKRPANE010
U400#1 U401#2 = XC7Z007S-1CLG225I: as U200 on sheet Zynq-Power; Manufacturer: Xilinx; Manufacturer Part Number: XC7Z007S-1CLG225I
U400#2 = W25Q128JVSIM: 128M-BIT / SERIAL FLASH MEMORY WITH / DUAL/QUAD SPI & QPI & DTR SOIC-8; Manufacturer: Winbond; Manufacturer Part Number: W25Q128JVSIM
U401#1 = SN74LVC1G07DRLR: Single Buffer/Driver With Open-Drain Output; Manufacturer: Texas Instruments; Manufacturer Part Number: SN74LVC1G07DRLR; Distributor Link: https://www.mouser.de/ProductDetail/Texas-Instruments/SN74LVC1G07DRLR?qs=pajgIaoyDUjwau6f5T7MtQ%3D%3D; LCSC: C183013
U402 = S40FC004C1B2I00000: eMMC MLC Memory 4GB 3V3; Manufacturer: SkyHigh Memory; Manufacturer Part Number: S40FC004C1B2I00000
X400 = ECS-2520MV-130-BN-TR: as X300 on sheet Zynq Config - JTAG - Debug; Manufacturer Part Number: ECS-2520MV-130-BN-TR

## Sheet Zynq DDR Interface & Termination.SchDoc: Zynq DDR Interface
size A3; DocumentNumber: 5; Revision: A; SheetNumber: 5; SheetTotal: 10
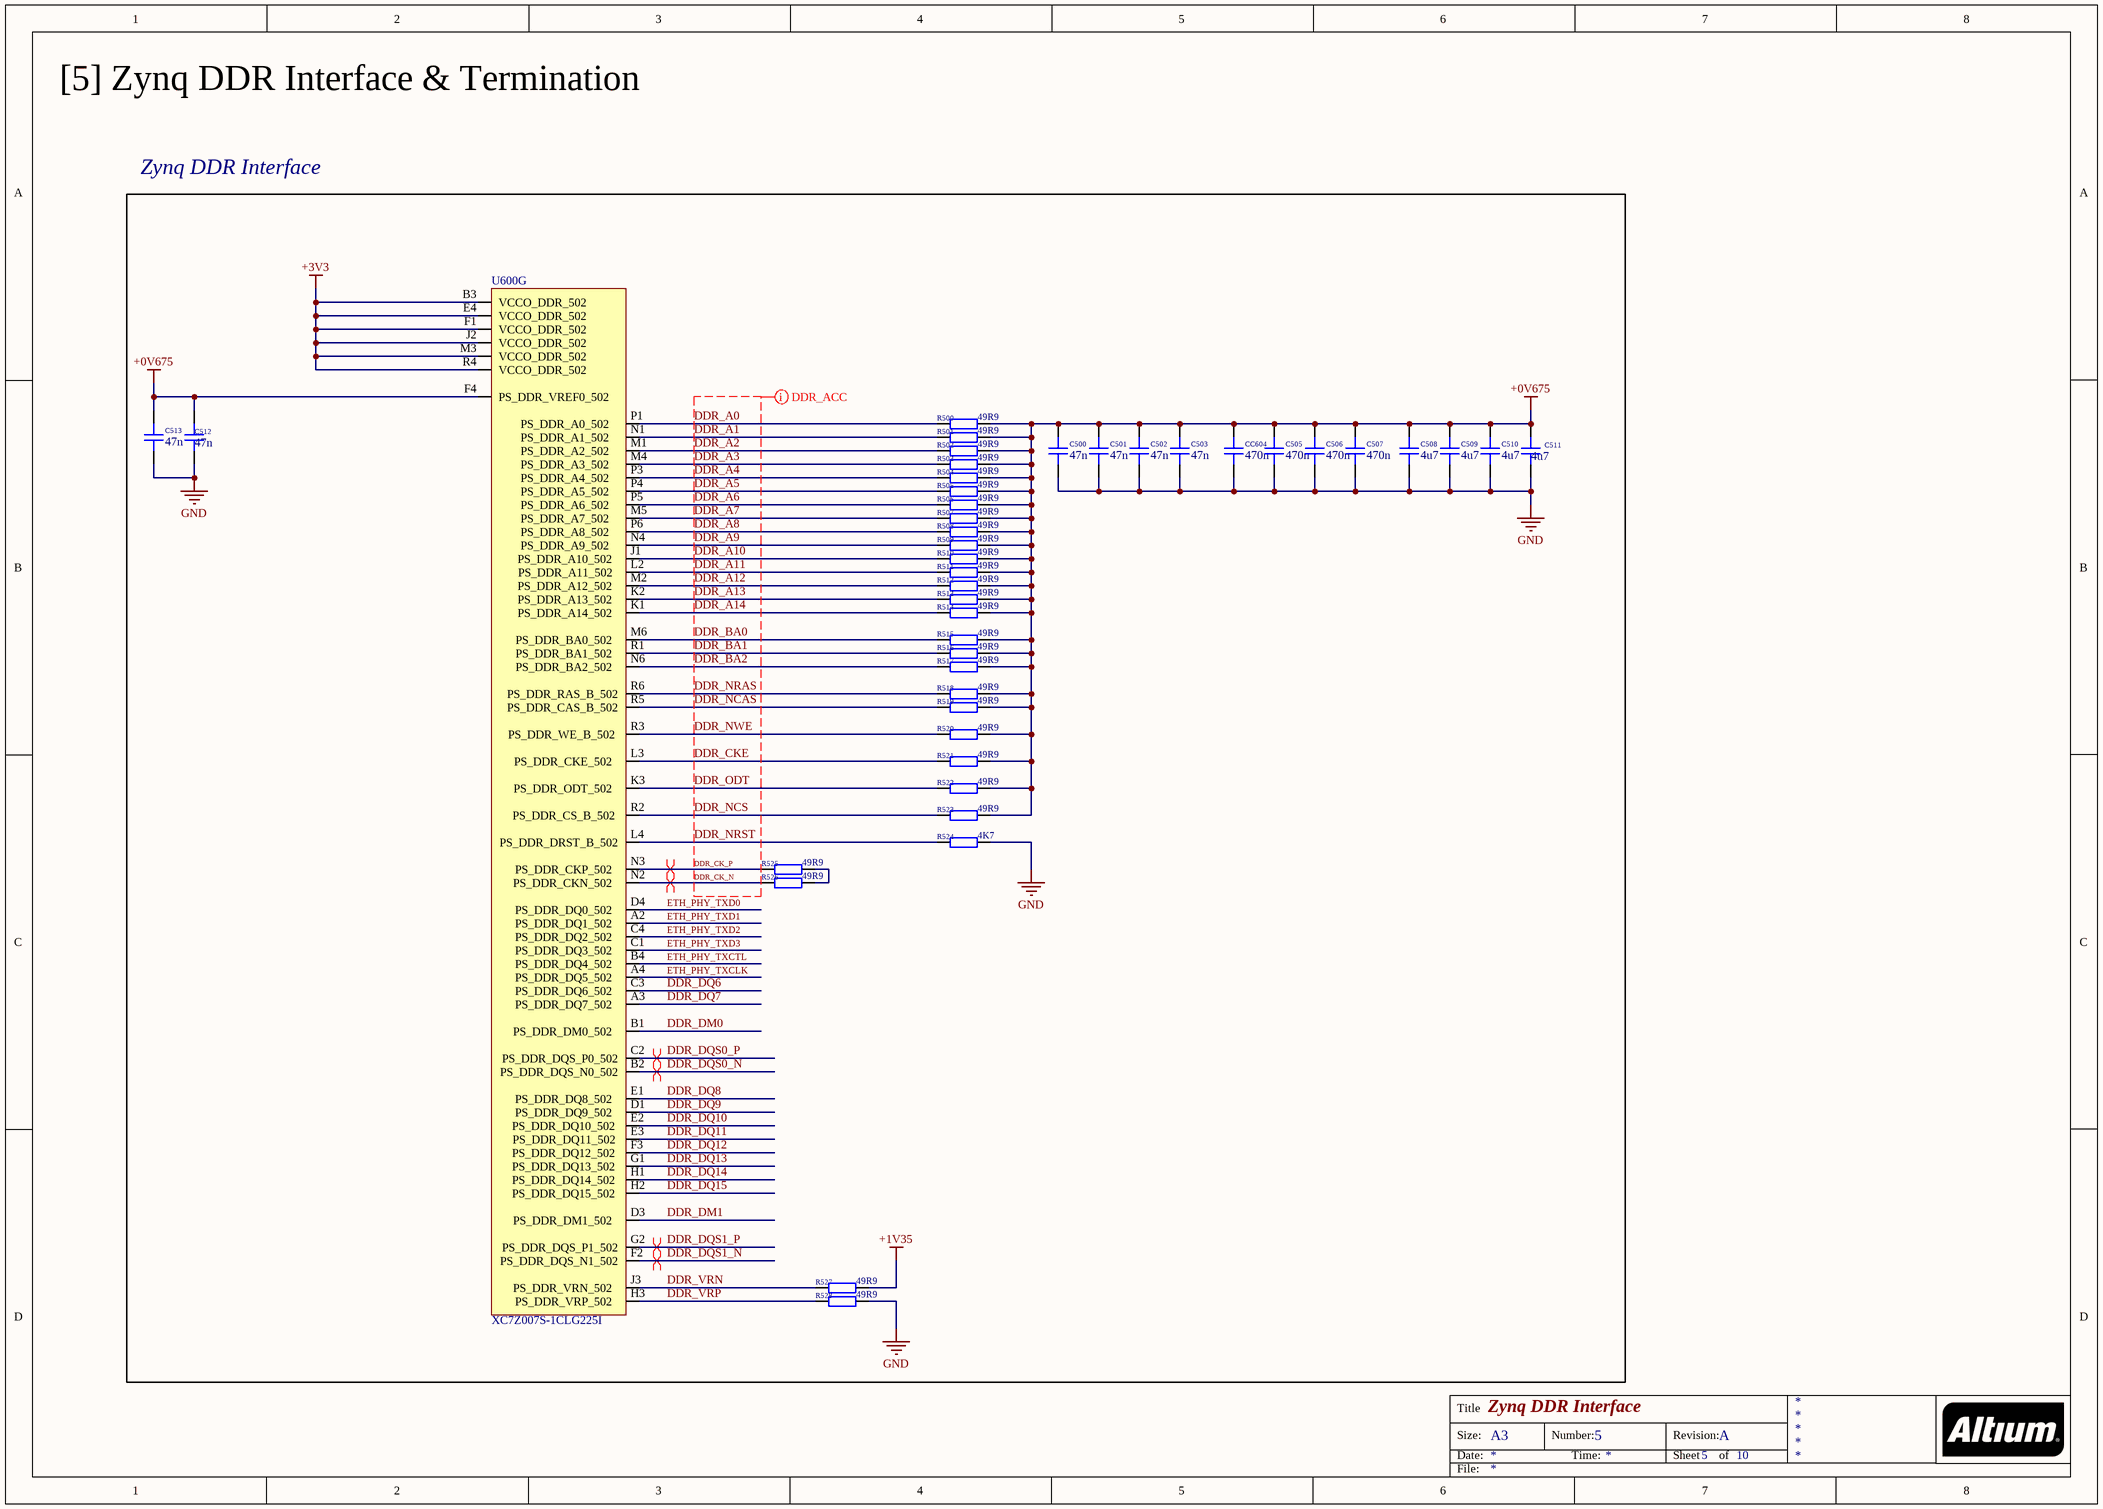
[diagram p5: Zynq DDR Interface & Termination.SchDoc]

### Parts
C500  47n  [CAP_1210]
C501  47n  [CAP_1210]
C502  47n  [CAP_1210]
C503  47n  [CAP_1210]
C505  470n  [CAP_1210]
C506  470n  [CAP_1210]
C507  470n  [CAP_1210]
C508  4u7  [CAP_1210]
C509  4u7  [CAP_1210]
C510  4u7  [CAP_1210]
C511  4u7  [CAP_1210]
C512  47n  [CAP_1210]
C513  47n  [CAP_1210]
CC604  470n  [CAP_1210]
R500  49R9  [RES_0402]
R501  49R9  [RES_0402]
R502  49R9  [RES_0402]
R503  49R9  [RES_0402]
R504  49R9  [RES_0402]
R505  49R9  [RES_0402]
R506  49R9  [RES_0402]
R507  49R9  [RES_0402]
R508  49R9  [RES_0402]
R509  49R9  [RES_0402]
R510  49R9  [RES_0402]
R511  49R9  [RES_0402]
R512  49R9  [RES_0402]
R513  49R9  [RES_0402]
R514  49R9  [RES_0402]
R515  49R9  [RES_0402]
R516  49R9  [RES_0402]
R517  49R9  [RES_0402]
R518  49R9  [RES_0402]
R519  49R9  [RES_0402]
R520  49R9  [RES_0402]
R521  49R9  [RES_0402]
R522  49R9  [RES_0402]
R523  49R9  [RES_0402]
R524  4K7  [RES_0402]
R525  49R9  [RES_0402]
R526  49R9  [RES_0402]
R527  49R9  [RES_0402]
R528  49R9  [RES_0402]
U600  XC7Z007S-1CLG225I  [CLG225]  (part G of 7)

### Blocks framed on the sheet
Zynq DDR Interface: C500-C503 C505-C513 CC604 R500-R528 U600

### Nets
+0V675: C500.2 C501.2 C502.2 C503.2 C505.2 C506.2 C507.2 C508.2 C509.2 C510.2 C511.2 C512.2 C513.2 CC604.2 R500.2 R501.2 R502.2 R503.2 R504.2 R505.2 R506.2 R507.2 R508.2 R509.2 R510.2 R511.2 R512.2 R513.2 R514.2 R515.2 R516.2 R517.2 R518.2 R519.2 R520.2 R521.2 R522.2 R523.2 U600.F4(PS_DDR_VREF0_502)
+1V35: R527.2
+3V3: U600.B3(VCCO_DDR_502) U600.E4(VCCO_DDR_502) U600.F1(VCCO_DDR_502) U600.J2(VCCO_DDR_502) U600.M3(VCCO_DDR_502) U600.R4(VCCO_DDR_502)
GND: C500.1 C501.1 C502.1 C503.1 C505.1 C506.1 C507.1 C508.1 C509.1 C510.1 C511.1 C512.1 C513.1 CC604.1 R524.2 R528.2  [project net FB_1V0]
DDR_A0: R500.1 U600.P1(PS_DDR_A0_502)
DDR_A1: R501.1 U600.N1(PS_DDR_A1_502)
DDR_A2: R502.1 U600.M1(PS_DDR_A2_502)
DDR_A3: R503.1 U600.M4(PS_DDR_A3_502)
DDR_A4: R504.1 U600.P3(PS_DDR_A4_502)
DDR_A5: R505.1 U600.P4(PS_DDR_A5_502)
DDR_A6: R506.1 U600.P5(PS_DDR_A6_502)
DDR_A7: R507.1 U600.M5(PS_DDR_A7_502)
DDR_A8: R508.1 U600.P6(PS_DDR_A8_502)
DDR_A9: R509.1 U600.N4(PS_DDR_A9_502)
DDR_A10: R510.1 U600.J1(PS_DDR_A10_502)
DDR_A11: R511.1 U600.L2(PS_DDR_A11_502)
DDR_A12: R512.1 U600.M2(PS_DDR_A12_502)
DDR_A13: R513.1 U600.K2(PS_DDR_A13_502)
DDR_A14: R514.1 U600.K1(PS_DDR_A14_502)
DDR_BA0: R515.1 U600.M6(PS_DDR_BA0_502)
DDR_BA1: R516.1 U600.R1(PS_DDR_BA1_502)
DDR_BA2: R517.1 U600.N6(PS_DDR_BA2_502)
DDR_CK_N: R526.1 U600.N2(PS_DDR_CKN_502)
DDR_CK_P: R525.1 U600.N3(PS_DDR_CKP_502)
DDR_CKE: R521.1 U600.L3(PS_DDR_CKE_502)
DDR_DM0: U600.B1(PS_DDR_DM0_502)
DDR_DM1: U600.D3(PS_DDR_DM1_502)
DDR_DQ6: U600.C3(PS_DDR_DQ6_502)
DDR_DQ7: U600.A3(PS_DDR_DQ7_502)
DDR_DQ8: U600.E1(PS_DDR_DQ8_502)
DDR_DQ9: U600.D1(PS_DDR_DQ9_502)
DDR_DQ10: U600.E2(PS_DDR_DQ10_502)
DDR_DQ11: U600.E3(PS_DDR_DQ11_502)
DDR_DQ12: U600.F3(PS_DDR_DQ12_502)
DDR_DQ13: U600.G1(PS_DDR_DQ13_502)
DDR_DQ14: U600.H1(PS_DDR_DQ14_502)
DDR_DQ15: U600.H2(PS_DDR_DQ15_502)
DDR_DQS0_N: U600.B2(PS_DDR_DQS_N0_502)
DDR_DQS0_P: U600.C2(PS_DDR_DQS_P0_502)
DDR_DQS1_N: U600.F2(PS_DDR_DQS_N1_502)
DDR_DQS1_P: U600.G2(PS_DDR_DQS_P1_502)
DDR_NCAS: R519.1 U600.R5(PS_DDR_CAS_B_502)
DDR_NCS: R523.1 U600.R2(PS_DDR_CS_B_502)
DDR_NRAS: R518.1 U600.R6(PS_DDR_RAS_B_502)
DDR_NRST: R524.1 U600.L4(PS_DDR_DRST_B_502)
DDR_NWE: R520.1 U600.R3(PS_DDR_WE_B_502)
DDR_ODT: R522.1 U600.K3(PS_DDR_ODT_502)
DDR_VRN: R527.1 U600.J3(PS_DDR_VRN_502)
DDR_VRP: R528.1 U600.H3(PS_DDR_VRP_502)
ETH_PHY_TXCLK: U600.A4(PS_DDR_DQ5_502)
ETH_PHY_TXCTL: U600.B4(PS_DDR_DQ4_502)
ETH_PHY_TXD0: U600.D4(PS_DDR_DQ0_502)
ETH_PHY_TXD1: U600.A2(PS_DDR_DQ1_502)
ETH_PHY_TXD2: U600.C4(PS_DDR_DQ2_502)
ETH_PHY_TXD3: U600.C1(PS_DDR_DQ3_502)
NetR525_2: R525.2 R526.2

### Layout directives
differential pair: DDR_CK_N, DDR_CK_P, DDR_DQS0_N, DDR_DQS0_P, DDR_DQS1_N, DDR_DQS1_P
mark named DDR_ACC: DDR_A0, DDR_A1, DDR_A2, DDR_A3, DDR_A4, DDR_A5, DDR_A6, DDR_A7, DDR_A8, DDR_A9, DDR_A10, DDR_A11, DDR_A12, DDR_A13, DDR_A14, DDR_BA0, DDR_BA1, DDR_BA2, DDR_CK_N, DDR_CK_P, DDR_CKE, DDR_NCAS, DDR_NCS, DDR_NRAS, DDR_NRST, DDR_NWE, DDR_ODT

### Notes on the sheet
- [5] Zynq DDR Interface & Termination
- Title
- Size:
- Date:
- A3
- Number:
- Time:
- Revision:
- Sheet
- of
- File:

### Library data of the parts
C500-C503 C505-C513 CC604 = CAP_1210: Capacitor SMD 1210; Manufacturer: *; Manufacturer Part Number: *; Distributor Link: *; LCSC: *; Rating: *; Dielectric: *
R500-R528 = RES_0402: Resistor SMD 0402; Manufacturer: *; Manufacturer Part Number: *; Distributor Link: *; LCSC: *
U600 = XC7Z007S-1CLG225I: as U200 on sheet Zynq-Power; Manufacturer: Xilinx; Manufacturer Part Number: XC7Z007S-1CLG225I

## Sheet Zynq Programmable Logic System (PL).SchDoc: Zynq Programmable Logic
size A3; DocumentNumber: 6; Revision: A; SheetNumber: 6; SheetTotal: 10
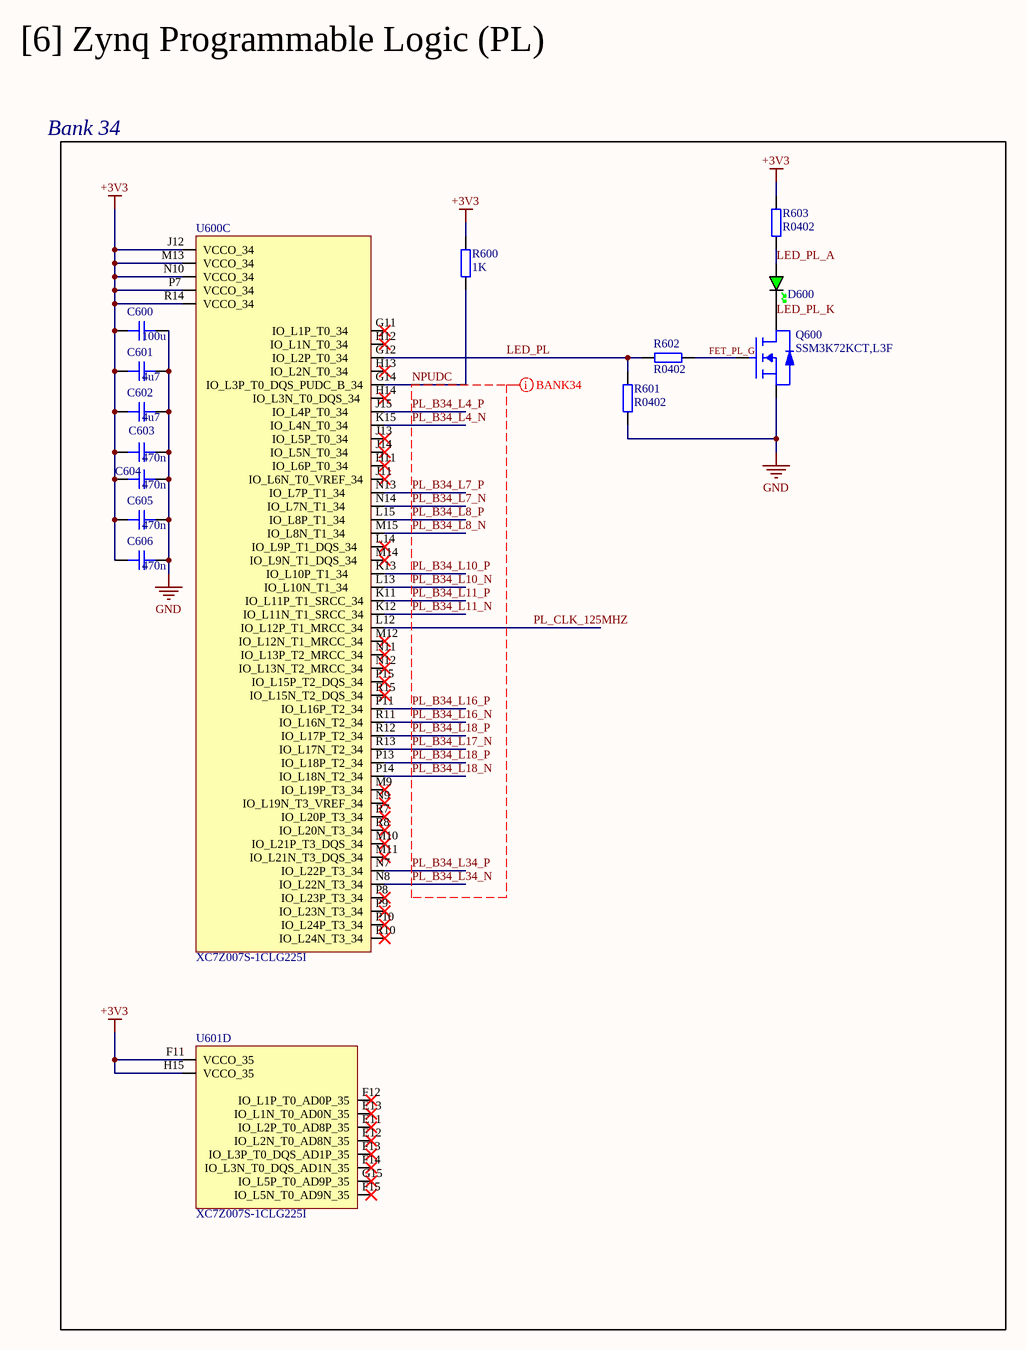
[diagram p6: Zynq Programmable Logic System (PL).SchDoc]

### Parts
C600  100u  [CAP_1210]
C601  4u7  [CAP_1210]
C602  4u7  [CAP_1210]
C603  470n  [CAP_1210]
C604  470n  [CAP_1210]
C605  470n  [CAP_1210]
C606  470n  [CAP_1210]
D600  GREEN  [LED_0402_GREEN]  (value not drawn)
Q600  SSM3K72KCT,L3F  [CST3-SOT-883]
R600  1K  [RES_0402]
R601  R0402  [RES_0402]
R602  R0402  [RES_0402]
R603  R0402  [RES_0402]
U600  XC7Z007S-1CLG225I  [CLG225]  (part C of 7)
U601  XC7Z007S-1CLG225I  [CLG225]  (part D of 7)

### Nets
+3V3: C600.1 C601.1 C602.1 C603.1 C604.1 C605.1 C606.1 R600.2 R603.2 U600.J12(VCCO_34) U600.M13(VCCO_34) U600.N10(VCCO_34) U600.P7(VCCO_34) U600.R14(VCCO_34) U601.F11(VCCO_35) U601.H15(VCCO_35)
GND: C600.2 C601.2 C602.2 C603.2 C604.2 C605.2 C606.2 Q600.S R601.1  [project net FB_1V0]
FET_PL_G: Q600.G R602.2
LED_PL: R601.2 R602.1 U600.G12(IO_L2P_T0_34)
LED_PL_A: D600.A R603.1
LED_PL_K: D600.K Q600.D
NPUDC: R600.1 U600.G14(IO_L3P_T0_DQS_PUDC_B_34)
PL_B34_L4_N: U600.K15(IO_L4N_T0_34)
PL_B34_L4_P: U600.J15(IO_L4P_T0_34)
PL_B34_L7_N: U600.N14(IO_L7N_T1_34)
PL_B34_L7_P: U600.N13(IO_L7P_T1_34)
PL_B34_L8_N: U600.M15(IO_L8N_T1_34)
PL_B34_L8_P: U600.L15(IO_L8P_T1_34)
PL_B34_L10_N: U600.L13(IO_L10N_T1_34)
PL_B34_L10_P: U600.K13(IO_L10P_T1_34)
PL_B34_L11_N: U600.K12(IO_L11N_T1_SRCC_34)
PL_B34_L11_P: U600.K11(IO_L11P_T1_SRCC_34)
PL_B34_L16_N: U600.R11(IO_L16N_T2_34)
PL_B34_L16_P: U600.P11(IO_L16P_T2_34)
PL_B34_L17_N: U600.R13(IO_L17N_T2_34)
PL_B34_L18_N: U600.P14(IO_L18N_T2_34)
PL_B34_L18_P: U600.P13(IO_L18P_T2_34) U600.R12(IO_L17P_T2_34)
PL_B34_L34_N: U600.N8(IO_L22N_T3_34)
PL_B34_L34_P: U600.N7(IO_L22P_T3_34)
PL_CLK_125MHZ: U600.L12(IO_L12P_T1_MRCC_34)

Not connected (* = marked no-connect by the designer): U600 G11  (IO_L1P_T0_34_____)* H11  (IO_L6P_T0_34_____)* H12  (IO_L1N_T0_34_____)* H13  (IO_L2N_T0_34_____)* H14  (IO_L3N_T0_DQS_34_)* J11  (IO_L6N_T0_VREF_34)* J13  (IO_L5P_T0_34_____)* J14  (IO_L5N_T0_34_____)* L14  (IO_L9P_T1_DQS_34__)* M9   (IO_L19P_T3_34)* M10  (IO_L21P_T3_DQS_34)* M11  (IO_L21N_T3_DQS_34)* M12  (IO_L12N_T1_MRCC_34)* M14  (IO_L9N_T1_DQS_34__)* N9   (IO_L19N_T3_VREF_34)* N11  (IO_L13P_T2_MRCC_34)* N12  (IO_L13N_T2_MRCC_34)* P8   (IO_L23P_T3_34)* P9   (IO_L23N_T3_34)* P10  (IO_L24P_T3_34)* P15  (IO_L15P_T2_DQS_34)* R7   (IO_L20P_T3_34)* R8   (IO_L20N_T3_34)* R10  (IO_L24N_T3_34)* R15  (IO_L15N_T2_DQS_34)*; U601 E11  (IO_L2P_T0_AD8P_35)* E12  (IO_L2N_T0_AD8N_35)* E13  (IO_L1N_T0_AD0N_35)* F12  (IO_L1P_T0_AD0P_35)* F13  (IO_L3P_T0_DQS_AD1P_35)* F14  (IO_L3N_T0_DQS_AD1N_35)* F15  (IO_L5N_T0_AD9N_35)* G15  (IO_L5P_T0_AD9P_35)*

### Layout directives
mark named BANK34: NPUDC, PL_B34_L4_N, PL_B34_L4_P, PL_B34_L7_N, PL_B34_L7_P, PL_B34_L8_N, PL_B34_L8_P, PL_B34_L10_N, PL_B34_L10_P, PL_B34_L11_N, PL_B34_L11_P, PL_B34_L16_N, PL_B34_L16_P, PL_B34_L17_N, PL_B34_L18_N, PL_B34_L18_P, PL_B34_L34_N, PL_B34_L34_P

### Notes on the sheet
- [6] Zynq Programmable Logic (PL)
- Bank 34
- Title
- Size:
- Date:
- A3
- Number:
- Time:
- Revision:
- Sheet
- of
- File:

### Library data of the parts
C600-C606 = CAP_1210: Capacitor SMD 1210; Manufacturer: *; Manufacturer Part Number: *; Distributor Link: *; LCSC: *; Rating: *; Dielectric: *
D600 = LED_0402_GREEN: LED 0402 GREEN SMD
Q600 = SSM3K72KCT,L3F: MOSFET N-Channel Vds=60V Id=400mA Rds(on)=1.05R with ESD Protection; Manufacturer: Toshiba; Manufacturer Part Number: SSM3K72KCT,L3F; Distributor Link: https://www.mouser.de/ProductDetail/Toshiba/SSM3K72KCTL3F?qs=PDgMCp4xDJZBSQ%2Fqg29QOw%3D%3D
R600-R603 = RES_0402: Resistor SMD 0402; Manufacturer: *; Manufacturer Part Number: *; Distributor Link: *; LCSC: *
U600 U601 = XC7Z007S-1CLG225I: as U200 on sheet Zynq-Power; Manufacturer: Xilinx; Manufacturer Part Number: XC7Z007S-1CLG225I

## Sheet Gigabit Ethernet.SchDoc: Gigabit Ethernet
size A3; DocumentNumber: 7; Revision: A; SheetNumber: 7; SheetTotal: 10
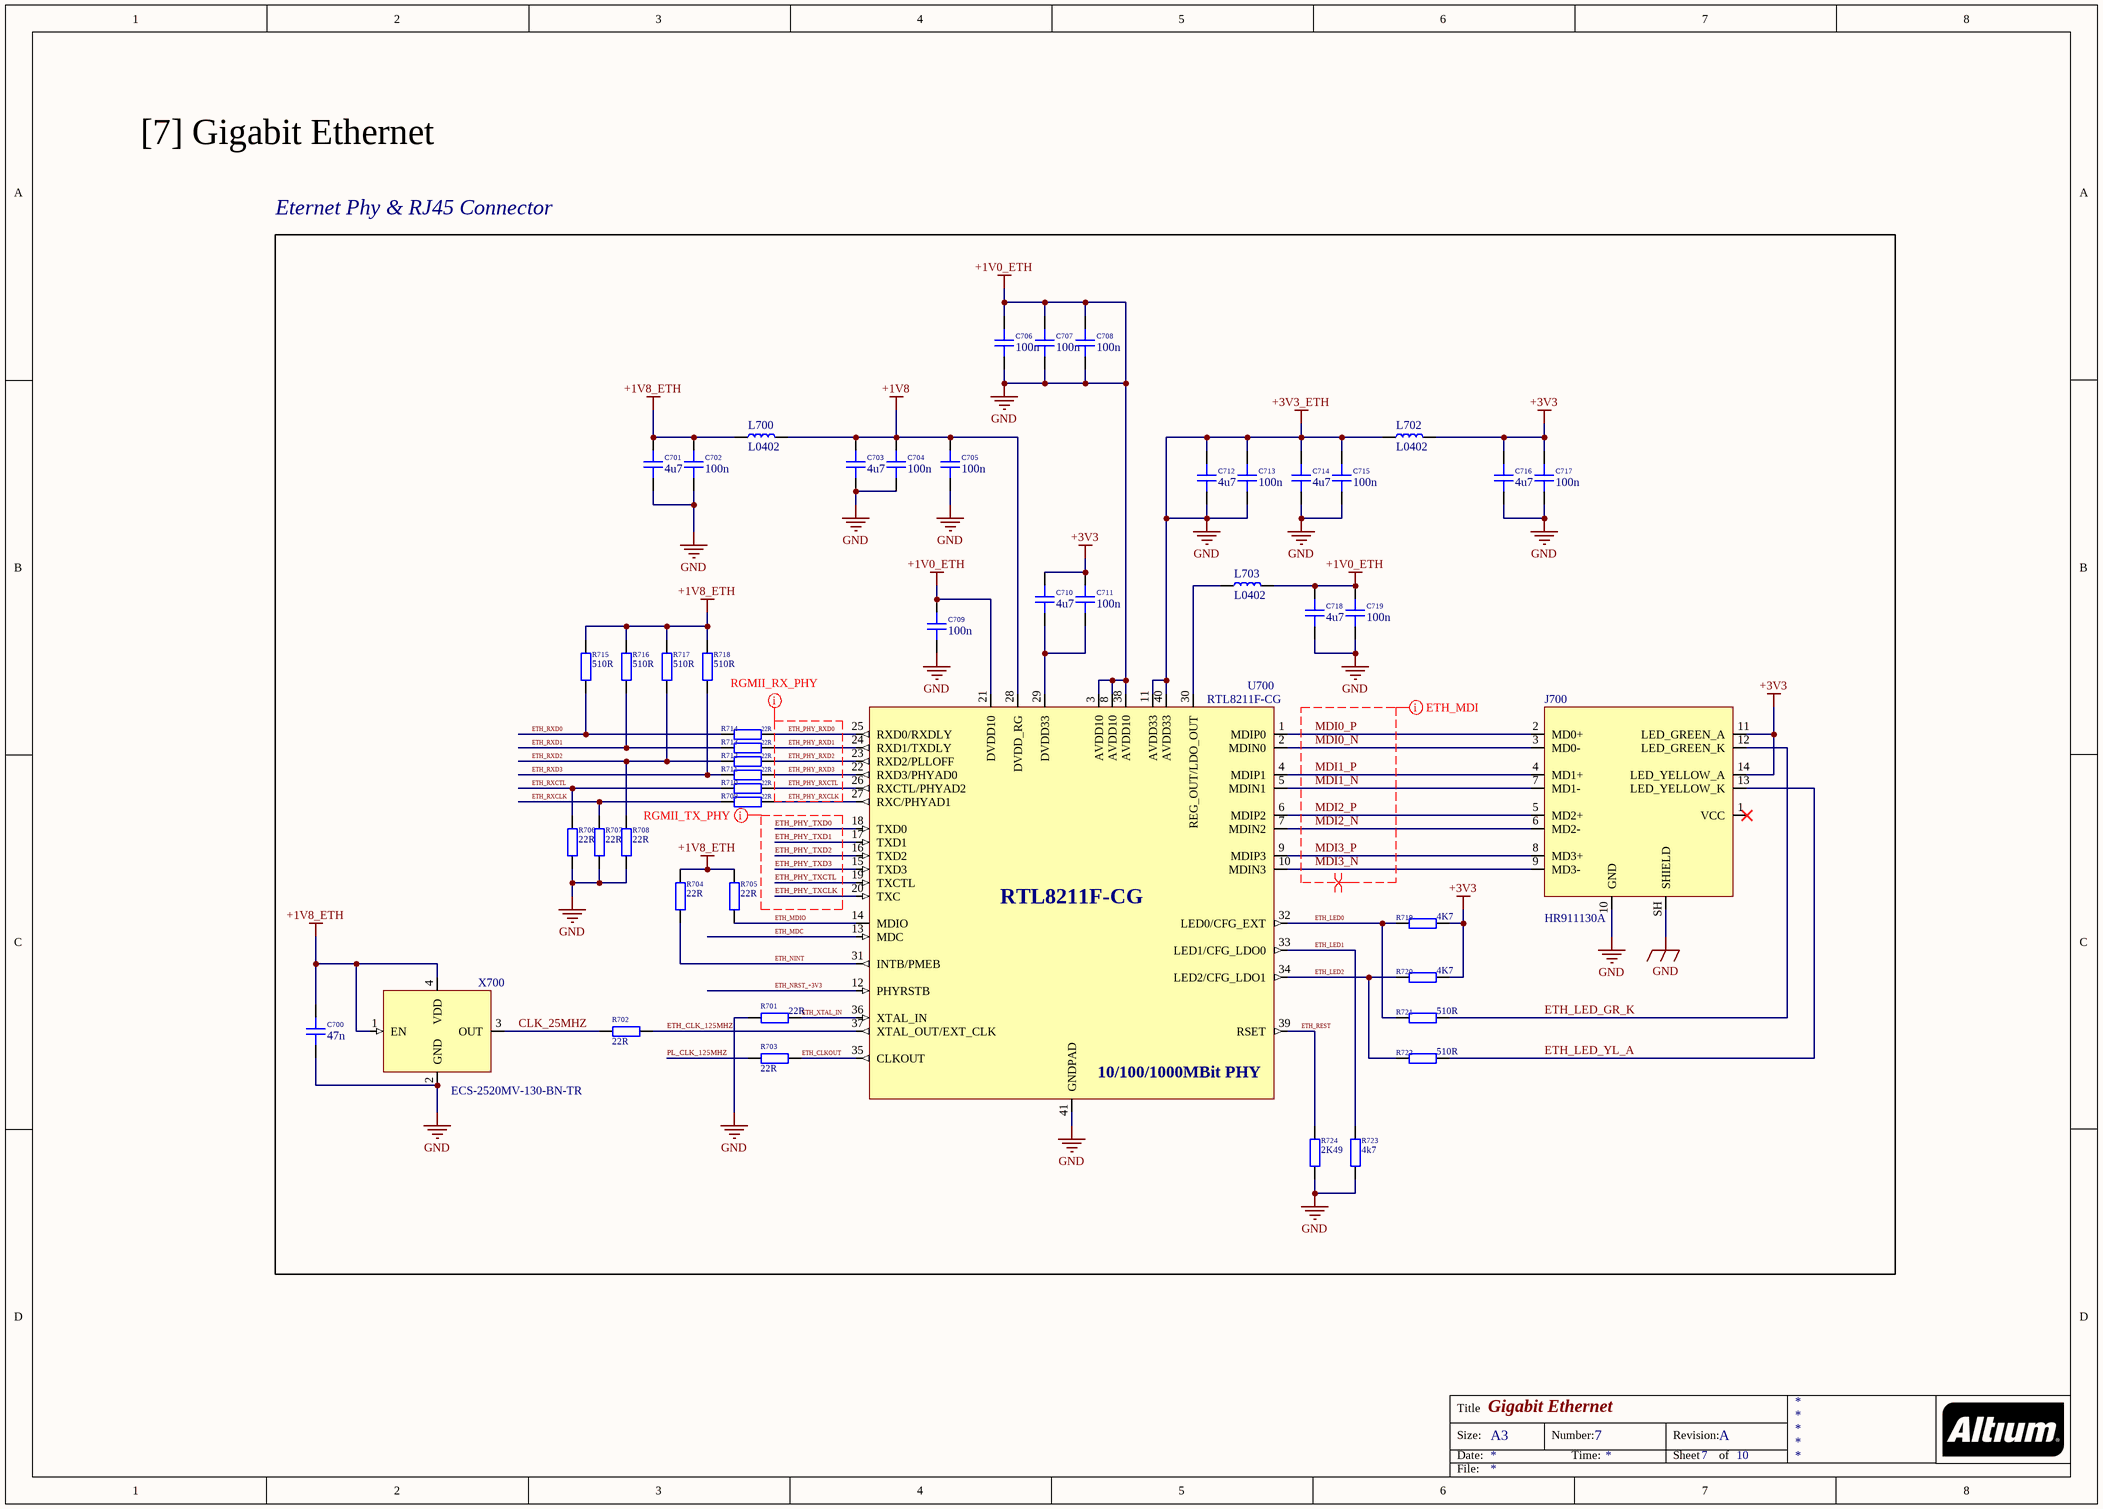
[diagram p7: Gigabit Ethernet.SchDoc]

### Parts
C700  47n  [CAP_1210]
C701  4u7  [CAP_1210]
C702  100n  [CAP_1210]
C703  4u7  [CAP_1210]
C704  100n  [CAP_1210]
C705  100n  [CAP_1210]
C706  100n  [CAP_1210]
C707  100n  [CAP_1210]
C708  100n  [CAP_1210]
C709  100n  [CAP_1210]
C710  4u7  [CAP_1210]
C711  100n  [CAP_1210]
C712  4u7  [CAP_1210]
C713  100n  [CAP_1210]
C714  4u7  [CAP_1210]
C715  100n  [CAP_1210]
C716  4u7  [CAP_1210]
C717  100n  [CAP_1210]
C718  4u7  [CAP_1210]
C719  100n  [CAP_1210]
J700  HR911130A  [HR911130A]
L700  L0402  [IND_0402]
L702  L0402  [IND_0402]
L703  L0402  [IND_0402]
R701  22R  [RES_0402]
R702  22R  [RES_0402]
R703  22R  [RES_0402]
R704  22R  [RES_0402]
R705  22R  [RES_0402]
R706  22R  [RES_0402]
R707  22R  [RES_0402]
R708  22R  [RES_0402]
R709  22R  [RES_0402]
R710  22R  [RES_0402]
R711  22R  [RES_0402]
R712  22R  [RES_0402]
R713  22R  [RES_0402]
R714  22R  [RES_0402]
R715  510R  [RES_0402]
R716  510R  [RES_0402]
R717  510R  [RES_0402]
R718  510R  [RES_0402]
R719  4K7  [RES_0402]
R720  4K7  [RES_0402]
R721  510R  [RES_0402]
R722  510R  [RES_0402]
R723  4k7  [RES_0402]
R724  2K49  [RES_0402]
U700  RTL8211F-CG  [QFN-40-0.4-EP]
X700  ECS-2520MV-130-BN-TR  [XTAL_2520]

### Blocks framed on the sheet
Eternet Phy & RJ45 Connector: C700-C719 J700 L700 L702 L703 R701-R724 U700 X700

### Nets
+1V0_ETH: C700.1 C701.1 C702.1 C703.1 C704.1 C705.1 C706.1 C706.2 C707.1 C707.2 C708.1 C708.2 C709.1 C709.2 C712.1 C712.2 C713.1 C713.2 C714.1 C714.2 C715.1 C715.2 C716.1 C717.1 C718.1 C718.2 C719.1 C719.2 J700.10(GND) J700.SH(SHIELD) L702.1 L703.2 R701.1 R706.1 R707.1 R708.1 R723.1 R724.1 U700.3(AVDD10) U700.8(AVDD10) U700.11(AVDD33) U700.21(DVDD10) U700.38(AVDD10) U700.40(AVDD33) U700.41(GNDPAD) X700.2(GND)  [also labelled +3V3_ETH, GND]  [project net FB_1V0]
+1V8: C703.2 C704.2 C705.2 L700.2 U700.28(DVDD_RG)
+1V8_ETH: C700.2 C701.2 C702.2 L700.1 R704.2 R705.2 R715.2 R716.2 R717.2 R718.2 X700.1(EN) X700.4(VDD)
+3V3: C710.2 C711.2 C716.2 C717.2 J700.11(LED_GREEN_A) J700.14(LED_YELLOW_A) L702.2 R719.2 R720.2
CLK_25MHZ: R702.2 X700.3(OUT)
ETH_CLK_125MHZ: R702.1 U700.37(XTAL_OUT/EXT_CLK)
ETH_CLKOUT: R703.1 U700.35(CLKOUT)
ETH_LED0: R719.1 R721.1 U700.32(LED0/CFG_EXT)
ETH_LED1: R723.2 U700.33(LED1/CFG_LDO0)
ETH_LED2: R720.1 R722.1 U700.34(LED2/CFG_LDO1)
ETH_LED_GR_K: J700.12(LED_GREEN_K) R721.2
ETH_LED_YL_A: J700.13(LED_YELLOW_K) R722.2
ETH_MDC: U700.13(MDC)
ETH_MDIO: R705.1 U700.14(MDIO)
ETH_NINT: R704.1 U700.31(INTB/PMEB)
ETH_NRST_+3V3: U700.12(PHYRSTB)
ETH_PHY_RXCLK: R709.2 U700.27(RXC/PHYAD1)
ETH_PHY_RXCTL: R710.2 U700.26(RXCTL/PHYAD2)
ETH_PHY_RXD0: R714.2 U700.25(RXD0/RXDLY)
ETH_PHY_RXD1: R713.2 U700.24(RXD1/TXDLY)
ETH_PHY_RXD2: R712.2 U700.23(RXD2/PLLOFF)
ETH_PHY_RXD3: R711.2 U700.22(RXD3/PHYAD0)
ETH_PHY_TXCLK: U700.20(TXC)
ETH_PHY_TXCTL: U700.19(TXCTL)
ETH_PHY_TXD0: U700.18(TXD0)
ETH_PHY_TXD1: U700.17(TXD1)
ETH_PHY_TXD2: U700.16(TXD2)
ETH_PHY_TXD3: U700.15(TXD3)
ETH_REST: R724.2 U700.39(RSET)
ETH_RXCLK: R707.2 R709.1
ETH_RXCTL: R706.2 R710.1
ETH_RXD0: R714.1 R715.1
ETH_RXD1: R713.1 R716.1
ETH_RXD2: R708.2 R712.1 R717.1
ETH_RXD3: R711.1 R718.1
ETH_XTAL_IN: R701.2 U700.36(XTAL_IN)
MDI0_N: J700.3(MD0-) U700.2(MDIN0)
MDI0_P: J700.2(MD0+) U700.1(MDIP0)
MDI1_N: J700.7(MD1-) U700.5(MDIN1)
MDI1_P: J700.4(MD1+) U700.4(MDIP1)
MDI2_N: J700.6(MD2-) U700.7(MDIN2)
MDI2_P: J700.5(MD2+) U700.6(MDIP2)
MDI3_N: J700.9(MD3-) U700.10(MDIN3)
MDI3_P: J700.8(MD3+) U700.9(MDIP3)
PL_CLK_125MHZ: R703.2
NetC710_1: C710.1 C711.1 U700.29(DVDD33)
NetL703_1: L703.1 U700.30(REG_OUT/LDO_OUT)

Not connected (* = marked no-connect by the designer): J700 1(VCC)*

### Layout directives
mark named ETH_MDI: MDI0_N, MDI0_P, MDI1_N, MDI1_P, MDI2_N, MDI2_P, MDI3_N, MDI3_P
differential pair: MDI0_N, MDI0_P, MDI1_N, MDI1_P, MDI2_N, MDI2_P, MDI3_N, MDI3_P
mark named RGMII_RX_PHY: ETH_PHY_RXCLK, ETH_PHY_RXCTL, ETH_PHY_RXD0, ETH_PHY_RXD1, ETH_PHY_RXD2, ETH_PHY_RXD3
mark named RGMII_TX_PHY: ETH_PHY_TXCLK, ETH_PHY_TXCTL, ETH_PHY_TXD0, ETH_PHY_TXD1, ETH_PHY_TXD2, ETH_PHY_TXD3

### Notes on the sheet
- [7] Gigabit Ethernet
- Title
- Size:
- Date:
- A3
- Number:
- Time:
- Revision:
- Sheet
- of
- File:
- (in symbol RTL8211F-CG) 10/100/1000MBit PHY

### Library data of the parts
C700-C719 = CAP_1210: Capacitor SMD 1210; Manufacturer: *; Manufacturer Part Number: *; Distributor Link: *; LCSC: *; Rating: *; Dielectric: *
J700 = HR911130A: 100/1000Base-T Magnetics Single-Port RJ45 Connector with Integrated Magnetics and LEDs; Manufacturer: Hanrun; Manufacturer Part Number: HR911130A
L700 L702 L703 = IND_0402: Inductor SMD 0402
R701-R724 = RES_0402: Resistor SMD 0402; Manufacturer: *; Manufacturer Part Number: *; Distributor Link: *; LCSC: *
U700 = RTL8211F-CG: INTEGRATED 10/100/1000M ETHERNET PRECISION TRANSCEIVER; Manufacturer: Realtek; Manufacturer Part Number: RTL8211F-CG
X700 = ECS-2520MV-130-BN-TR: as X300 on sheet Zynq Config - JTAG - Debug; Manufacturer Part Number: ECS-2520MV-130-BN-TR

## Sheet USB 2 High Speed (OTG).SchDoc: USB 2.0 High speed (OTG)
size A3; DocumentNumber: 8; Revision: A; SheetNumber: 8; SheetTotal: 10
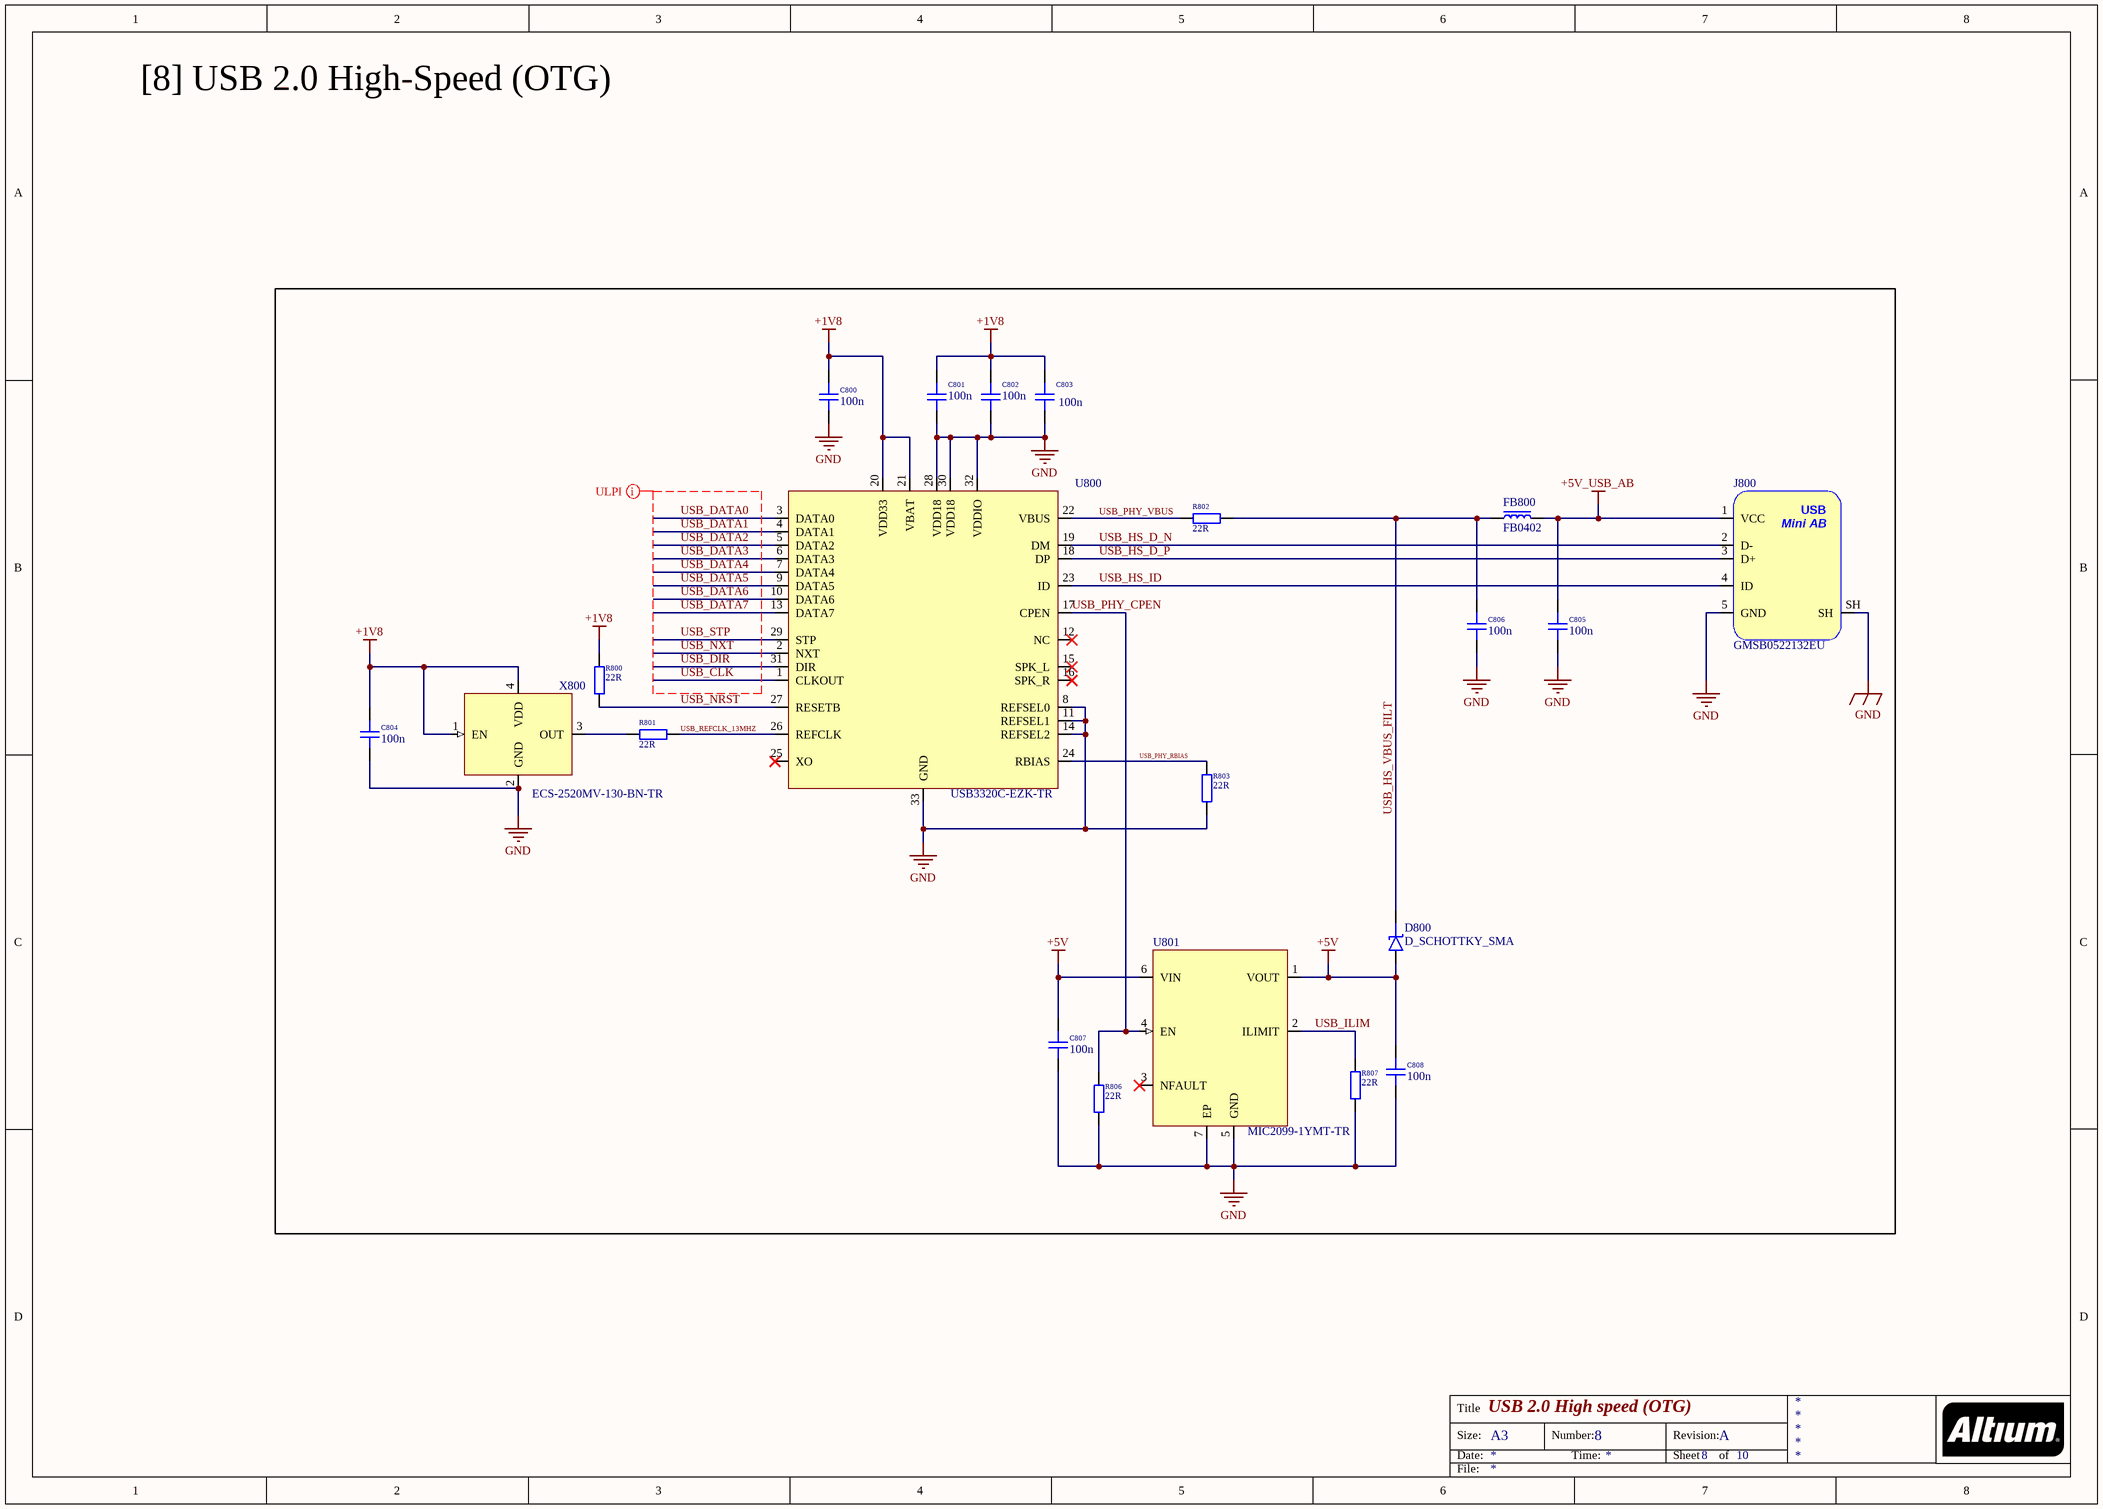
[diagram p8: USB 2 High Speed (OTG).SchDoc]

### Parts
C800  100n  [CAP_1210]
C801  100n  [CAP_1210]
C802  100n  [CAP_1210]
C803  100n  [CAP_1210]
C804  100n  [CAP_1210]
C805  100n  [CAP_1210]
C806  100n  [CAP_1210]
C807  100n  [CAP_1210]
C808  100n  [CAP_1210]
D800  D_SCHOTTKY_SMA  [DO-214AC-2 (SMA)]
FB800  FB0402  [FB_0402]
J800  GMSB0522132EU  [GMSB0522132EU]
R800  22R  [RES_0402]
R801  22R  [RES_0402]
R802  22R  [RES_0402]
R803  22R  [RES_0402]
R806  22R  [RES_0402]
R807  22R  [RES_0402]
U800  USB3320C-EZK-TR  [QFN-32-5x5x0.85mm]
U801  MIC2099-1YMT-TR  [TMLF-6-1_6X1_6]
X800  ECS-2520MV-130-BN-TR  [XTAL_2520]

### Nets
+1V8: C800.2 C801.2 C802.2 C803.2 C804.2 R800.1 U800.20(VDD33) U800.21(VBAT) X800.1(EN) X800.4(VDD)
+5V: C807.2 C808.2 D800.A U801.1(VOUT) U801.6(VIN)
+5V_USB_AB: C805.2 FB800.2 J800.1(VCC)
GND: C800.1 C801.1 C802.1 C803.1 C804.1 C805.1 C806.1 C807.1 C808.1 J800.5(GND) J800.SH R803.2 R806.2 R807.2 U800.8(REFSEL0) U800.11(REFSEL1) U800.14(REFSEL2) U800.28(VDD18) U800.30(VDD18) U800.32(VDDIO) U800.33(GND) U801.5(GND) U801.7(EP) X800.2(GND)  [project net FB_1V0]
USB_CLK: U800.1(CLKOUT)
USB_DATA0: U800.3(DATA0)
USB_DATA1: U800.4(DATA1)
USB_DATA2: U800.5(DATA2)
USB_DATA3: U800.6(DATA3)
USB_DATA4: U800.7(DATA4)
USB_DATA5: U800.9(DATA5)
USB_DATA6: U800.10(DATA6)
USB_DATA7: U800.13(DATA7)
USB_DIR: U800.31(DIR)
USB_HS_D_N: J800.2(D-) U800.19(DM)
USB_HS_D_P: J800.3(D+) U800.18(DP)
USB_HS_ID: J800.4(ID) U800.23(ID)
USB_HS_VBUS_FILT: C806.2 D800.K FB800.1 R802.1
USB_ILIM: R807.1 U801.2(ILIMIT)
USB_NRST: R800.2 U800.27(RESETB)
USB_NXT: U800.2(NXT)
USB_PHY_CPEN: R806.1 U800.17(CPEN) U801.4(EN)
USB_PHY_RBIAS: R803.1 U800.24(RBIAS)
USB_PHY_VBUS: R802.2 U800.22(VBUS)
USB_REFCLK_13MHZ: R801.1 U800.26(REFCLK)
USB_STP: U800.29(STP)
NetR801_2: R801.2 X800.3(OUT)

Not connected (* = marked no-connect by the designer): U800 12(NC)* 15(SPK_L)* 16(SPK_R)* 25(XO)*; U801 3(NFAULT)*

### Layout directives
mark named ULPI: USB_CLK, USB_DATA0, USB_DATA1, USB_DATA2, USB_DATA3, USB_DATA4, USB_DATA5, USB_DATA6, USB_DATA7, USB_DIR, USB_NXT, USB_STP

### Notes on the sheet
- [8] USB 2.0 High-Speed (OTG)
- Title
- Size:
- Date:
- A3
- Number:
- Time:
- Revision:
- Sheet
- of
- File:
- (in symbol GMSB0522132EU) USB; Mini AB

### Library data of the parts
C800-C808 = CAP_1210: Capacitor SMD 1210; Manufacturer: *; Manufacturer Part Number: *; Distributor Link: *; LCSC: *; Rating: *; Dielectric: *
D800 = D_SCHOTTKY_SMA: Diode Schottky SMD SMA (DO-214AA)
FB800 = FB_0402: Ferrite Bead SMD 0402; Manufacturer: *; Manufacturer Part Number: *; Distributor Link: *; LCSC: *
J800 = GMSB0522132EU: USB 2.0 Mini AB Receptacle Right Angle Through-Hole; Manufacturer: Amphenol; Manufacturer Part Number: GMSB0522132EU
R800-R803 R806 R807 = RES_0402: Resistor SMD 0402; Manufacturer: *; Manufacturer Part Number: *; Distributor Link: *; LCSC: *
U800 = USB3320C-EZK-TR: Hi-Speed USB 2.0 ULPI Transceiver; Manufacturer: Microchip; Manufacturer Part Number: USB3320C-EZK-TR
U801 = MIC2099-1YMT-TR: Power Distribution Switch Resistor programmable current limit / – 0.1A to 1.1A 2.5V-5.5V; Manufacturer: Microchip; Manufacturer Part Number: MIC2099-1YMT-TR
X800 = ECS-2520MV-130-BN-TR: as X300 on sheet Zynq Config - JTAG - Debug; Manufacturer Part Number: ECS-2520MV-130-BN-TR

## Sheet DDR3L.SchDoc: DDR3L
size A3; SheetNumber: 9; SheetTotal: 10
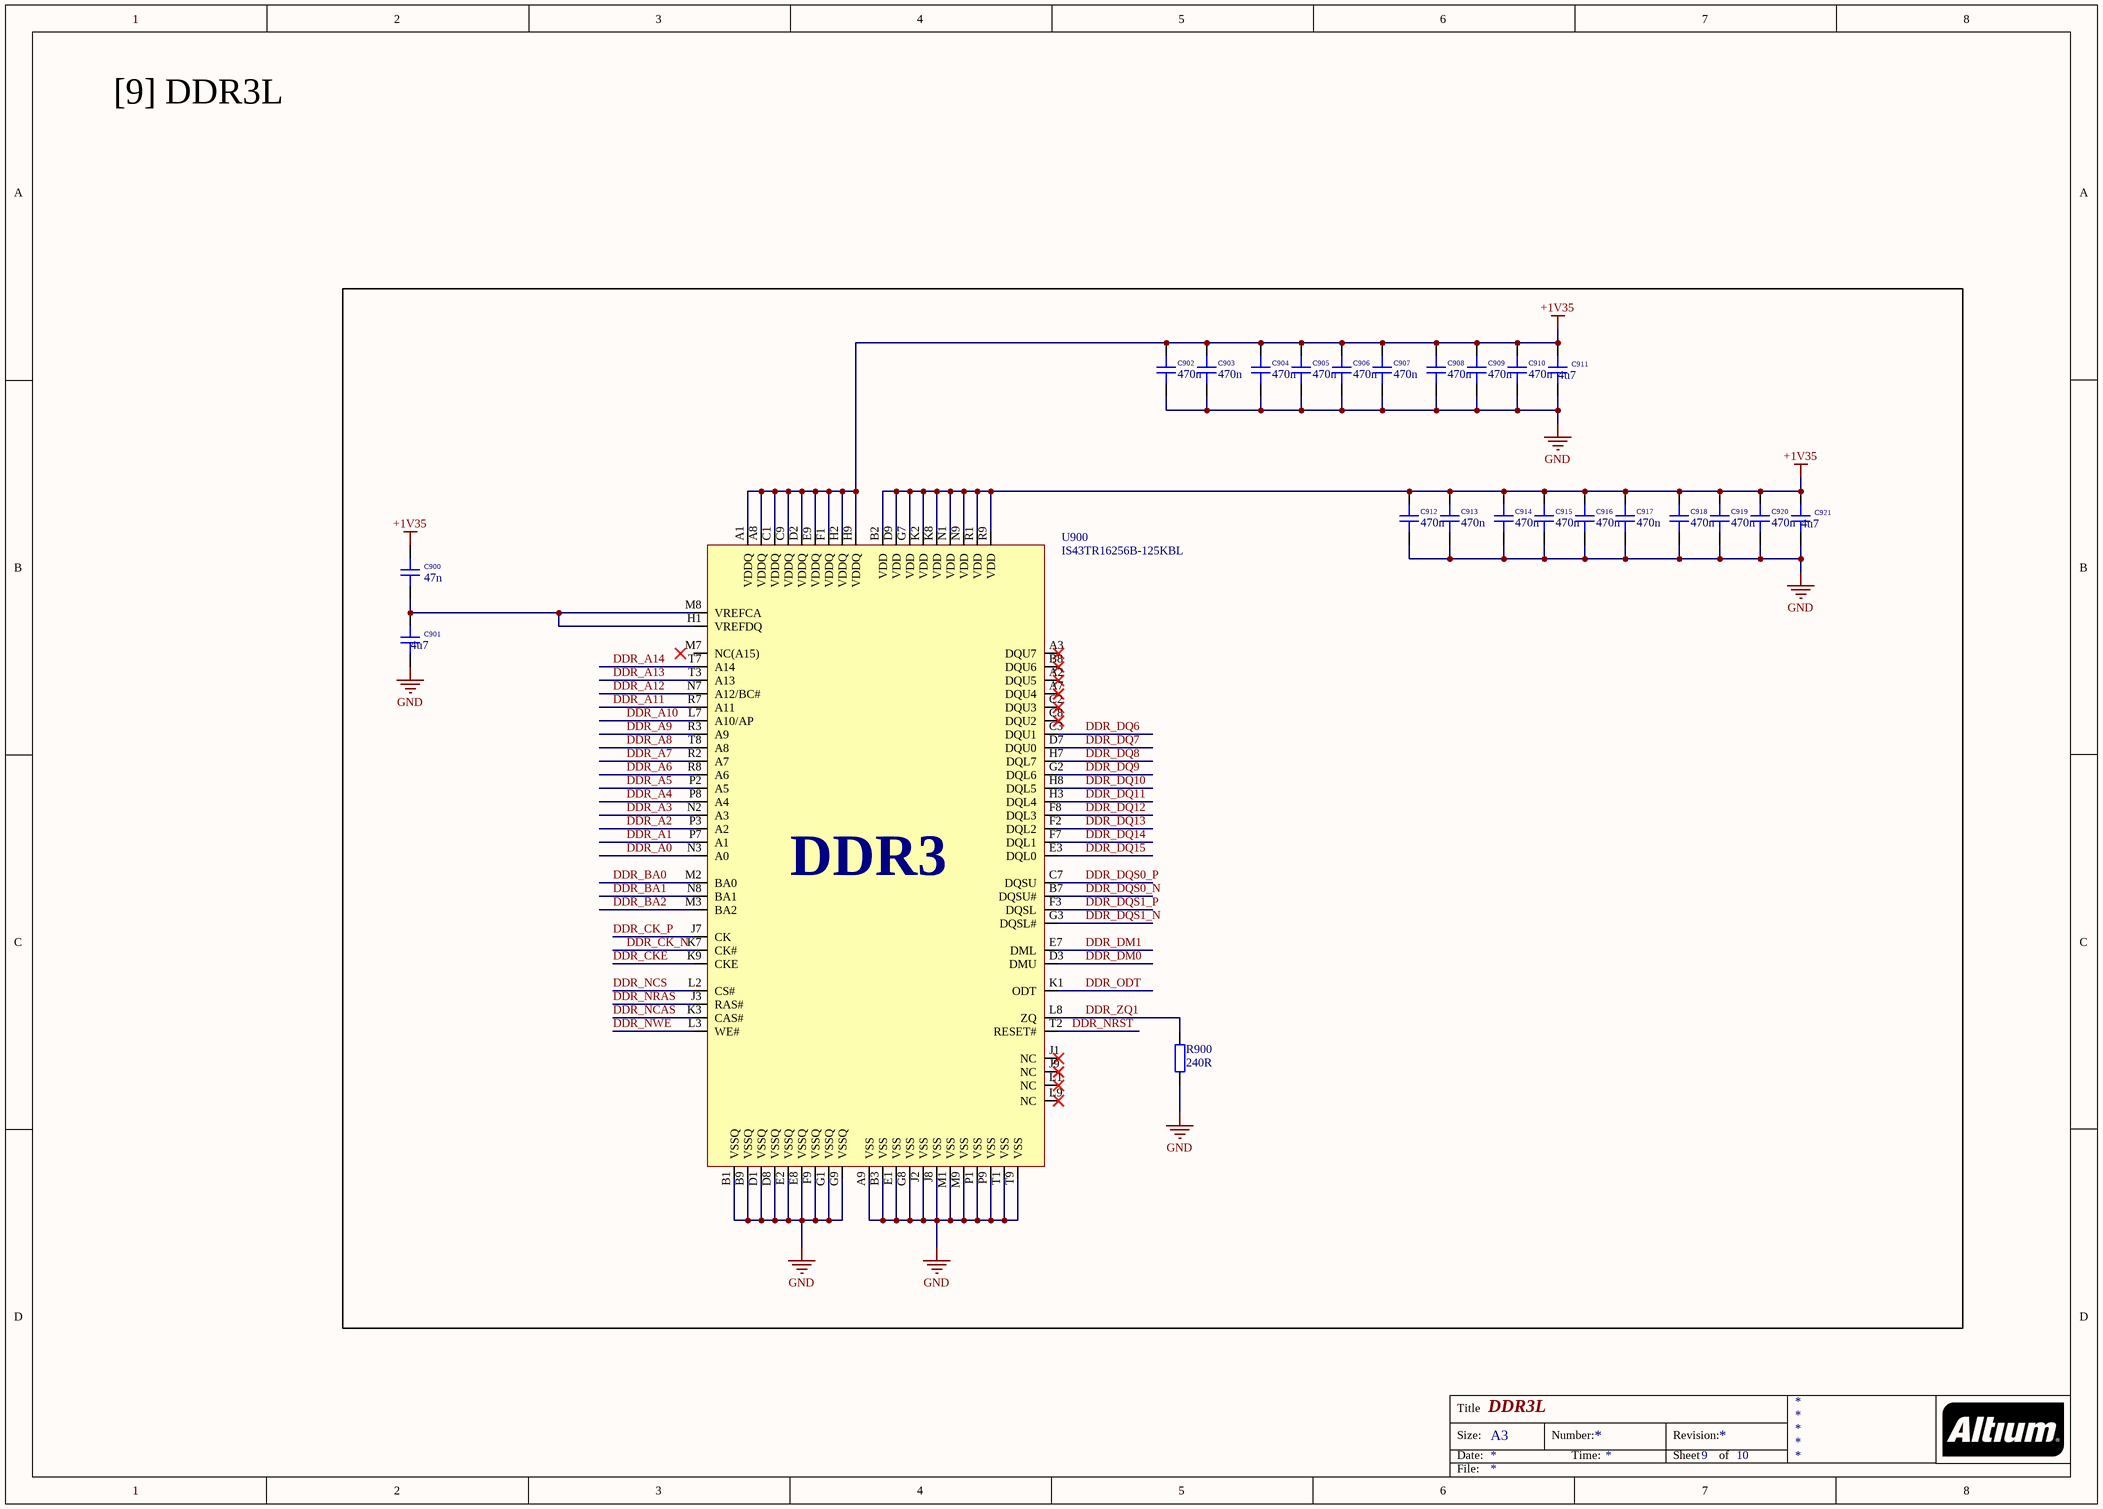
[diagram p9: DDR3L.SchDoc]

### Parts
C900  47n  [CAP_1210]
C901  4u7  [CAP_1210]
C902  470n  [CAP_1210]
C903  470n  [CAP_1210]
C904  470n  [CAP_1210]
C905  470n  [CAP_1210]
C906  470n  [CAP_1210]
C907  470n  [CAP_1210]
C908  470n  [CAP_1210]
C909  470n  [CAP_1210]
C910  470n  [CAP_1210]
C911  4u7  [CAP_1210]
C912  470n  [CAP_1210]
C913  470n  [CAP_1210]
C914  470n  [CAP_1210]
C915  470n  [CAP_1210]
C916  470n  [CAP_1210]
C917  470n  [CAP_1210]
C918  470n  [CAP_1210]
C919  470n  [CAP_1210]
C920  470n  [CAP_1210]
C921  4u7  [CAP_1210]
R900  240R  [RES_0402]
U900  IS43TR16256B-125KBL  [BGA96C80P9X16_900X1300X120]

### Nets
+1V35: C900.2 C902.2 C903.2 C904.2 C905.2 C906.2 C907.2 C908.2 C909.2 C910.2 C911.2 C912.2 C913.2 C914.2 C915.2 C916.2 C917.2 C918.2 C919.2 C920.2 C921.2 U900.A1(VDDQ) U900.A8(VDDQ) U900.B2(VDD) U900.C1(VDDQ) U900.C9(VDDQ) U900.D2(VDDQ) U900.D9(VDD) U900.E9(VDDQ) U900.F1(VDDQ) U900.G7(VDD) U900.H2(VDDQ) U900.H9(VDDQ) U900.K2(VDD) U900.K8(VDD) U900.N1(VDD) U900.N9(VDD) U900.R1(VDD) U900.R9(VDD)
GND: C901.1 C902.1 C903.1 C904.1 C905.1 C906.1 C907.1 C908.1 C909.1 C910.1 C911.1 C912.1 C913.1 C914.1 C915.1 C916.1 C917.1 C918.1 C919.1 C920.1 C921.1 R900.2 U900.A9(VSS) U900.B1(VSSQ) U900.B3(VSS) U900.B9(VSSQ) U900.D1(VSSQ) U900.D8(VSSQ) U900.E1(VSS) U900.E2(VSSQ) U900.E8(VSSQ) U900.F9(VSSQ) U900.G1(VSSQ) U900.G8(VSS) U900.G9(VSSQ) U900.J2(VSS) U900.J8(VSS) U900.M1(VSS) U900.M9(VSS) U900.P1(VSS) U900.P9(VSS) U900.T1(VSS) U900.T9(VSS)  [project net FB_1V0]
DDR_A0: U900.N3(A0)
DDR_A1: U900.P7(A1)
DDR_A2: U900.P3(A2)
DDR_A3: U900.N2(A3)
DDR_A4: U900.P8(A4)
DDR_A5: U900.P2(A5)
DDR_A6: U900.R8(A6)
DDR_A7: U900.R2(A7)
DDR_A8: U900.T8(A8)
DDR_A9: U900.R3(A9)
DDR_A10: U900.L7(A10/AP)
DDR_A11: U900.R7(A11)
DDR_A12: U900.N7(A12/BC#)
DDR_A13: U900.T3(A13)
DDR_A14: U900.T7(A14)
DDR_BA0: U900.M2(BA0)
DDR_BA1: U900.N8(BA1)
DDR_BA2: U900.M3(BA2)
DDR_CK_N: U900.K7(CK#)
DDR_CK_P: U900.J7(CK)
DDR_CKE: U900.K9(CKE)
DDR_DM0: U900.D3(DMU)
DDR_DM1: U900.E7(DML)
DDR_DQ6: U900.C3(DQU1)
DDR_DQ7: U900.D7(DQU0)
DDR_DQ8: U900.H7(DQL7)
DDR_DQ9: U900.G2(DQL6)
DDR_DQ10: U900.H8(DQL5)
DDR_DQ11: U900.H3(DQL4)
DDR_DQ12: U900.F8(DQL3)
DDR_DQ13: U900.F2(DQL2)
DDR_DQ14: U900.F7(DQL1)
DDR_DQ15: U900.E3(DQL0)
DDR_DQS0_N: U900.B7(DQSU#)
DDR_DQS0_P: U900.C7(DQSU)
DDR_DQS1_N: U900.G3(DQSL#)
DDR_DQS1_P: U900.F3(DQSL)
DDR_NCAS: U900.K3(CAS#)
DDR_NCS: U900.L2(CS#)
DDR_NRAS: U900.J3(RAS#)
DDR_NRST: U900.T2(RESET#)
DDR_NWE: U900.L3(WE#)
DDR_ODT: U900.K1(ODT)
DDR_ZQ1: R900.1 U900.L8(ZQ)
NetC900_1: C900.1 C901.2 U900.H1(VREFDQ) U900.M8(VREFCA)

Not connected (* = marked no-connect by the designer): U900 A2(DQU5)* A3(DQU7)* A7(DQU4)* B8(DQU6)* C2(DQU3)* C8(DQU2)* J1(NC)* J9(NC)* L1(NC)* L9(NC)* M7(NC(A15))

### Notes on the sheet
- [9] DDR3L
- Title
- Size:
- Date:
- A3
- Number:
- Time:
- Revision:
- Sheet
- of
- File:
- (in symbol IS43TR16256B-125KBL) DDR3

### Library data of the parts
C900-C921 = CAP_1210: Capacitor SMD 1210; Manufacturer: *; Manufacturer Part Number: *; Distributor Link: *; LCSC: *; Rating: *; Dielectric: *
R900 = RES_0402: Resistor SMD 0402; Manufacturer: *; Manufacturer Part Number: *; Distributor Link: *; LCSC: *
U900 = IS43TR16256B-125KBL: DRAM 4GBit, 1.5V, DDR3, 256Mx16, 1600MT/s @ 11-11-11, 96 ball BGA (9mm x13mm) RoHS; Manufacturer: ISSI; Manufacturer Part Number: IS43TR16256B-125KBL

## Sheet Mezzanine.SchDoc: Mezzanine
size A3; DocumentNumber: 10; Revision: A; SheetNumber: 10; SheetTotal: 10
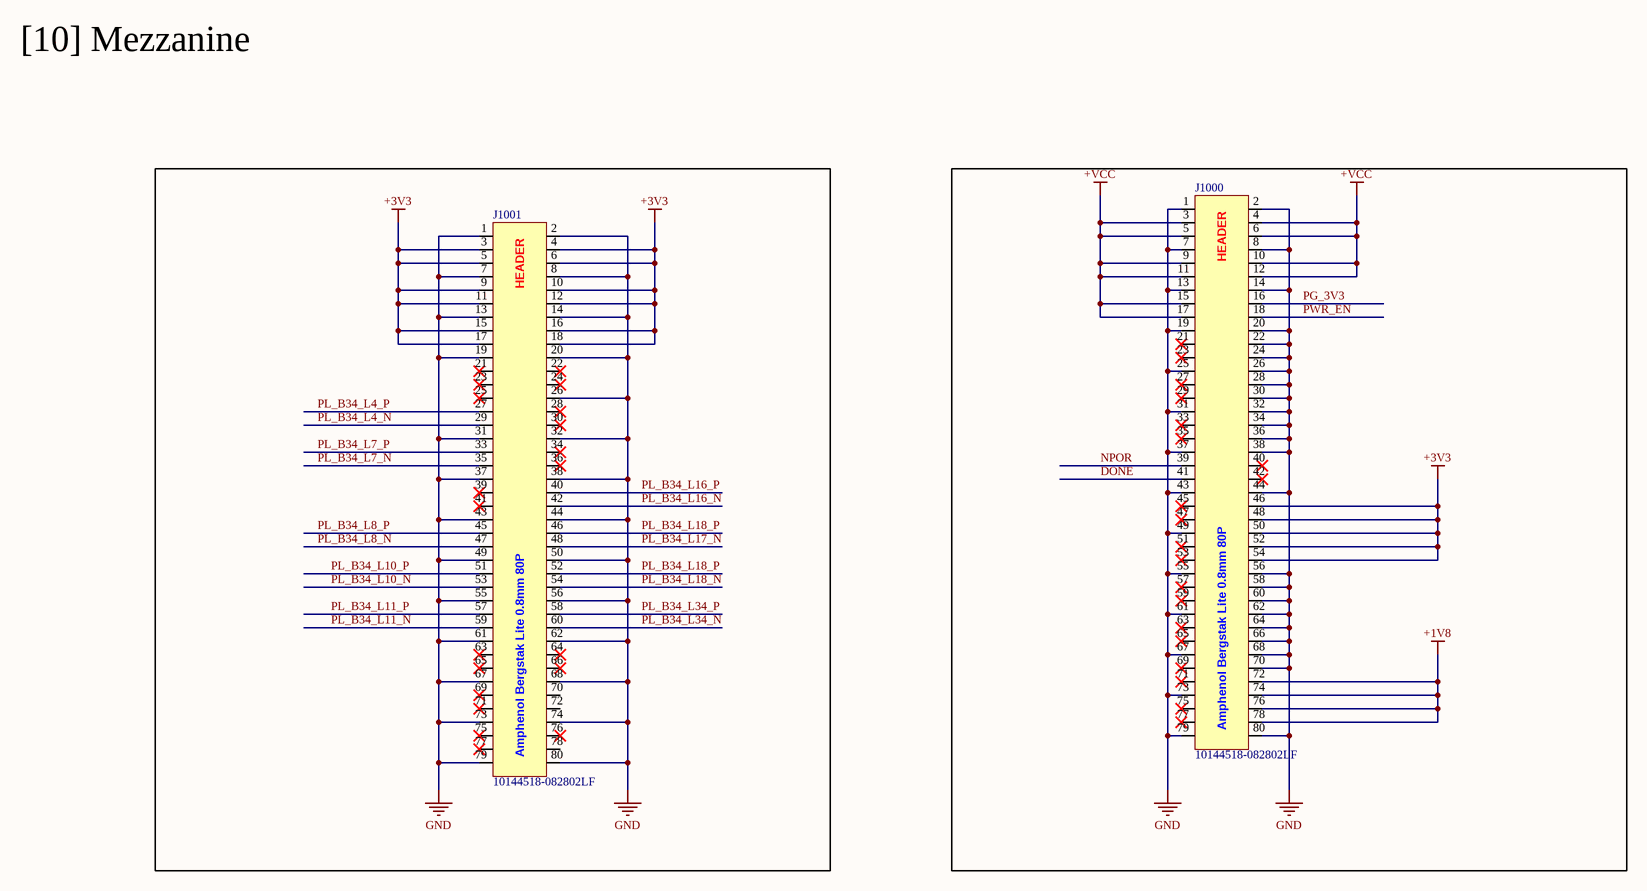
[diagram p10: Mezzanine.SchDoc]

### Parts
J1000  10144518-082802LF  [10144518-082802LF]
J1001  10144518-082802LF  [10144518-082802LF]

### Nets
+1V8: J1000.72 J1000.74 J1000.76 J1000.78
+3V3: J1000.46 J1000.48 J1000.50 J1000.52 J1000.54 J1001.3 J1001.4 J1001.5 J1001.6 J1001.9 J1001.10 J1001.11 J1001.12 J1001.15 J1001.16 J1001.17 J1001.18
+VCC: J1000.3 J1000.4 J1000.5 J1000.6 J1000.9 J1000.10 J1000.11 J1000.12 J1000.15 J1000.17
GND: J1000.1 J1000.2 J1000.7 J1000.8 J1000.13 J1000.14 J1000.19 J1000.20 J1000.22 J1000.24 J1000.25 J1000.26 J1000.28 J1000.30 J1000.31 J1000.32 J1000.34 J1000.36 J1000.37 J1000.38 J1000.43 J1000.44 J1000.49 J1000.55 J1000.56 J1000.58 J1000.60 J1000.61 J1000.62 J1000.64 J1000.66 J1000.67 J1000.68 J1000.70 J1000.73 J1000.79 J1000.80 J1001.1 J1001.2 J1001.7 J1001.8 J1001.13 J1001.14 J1001.19 J1001.20 J1001.26 J1001.31 J1001.32 J1001.37 J1001.38 J1001.43 J1001.44 J1001.49 J1001.50 J1001.55 J1001.56 J1001.61 J1001.62 J1001.67 J1001.68 J1001.73 J1001.74 J1001.79 J1001.80  [project net FB_1V0]
DONE: J1000.41
NPOR: J1000.39
PG_3V3: J1000.16
PL_B34_L4_N: J1001.29
PL_B34_L4_P: J1001.27
PL_B34_L7_N: J1001.35
PL_B34_L7_P: J1001.33
PL_B34_L8_N: J1001.47
PL_B34_L8_P: J1001.45
PL_B34_L10_N: J1001.53
PL_B34_L10_P: J1001.51
PL_B34_L11_N: J1001.59
PL_B34_L11_P: J1001.57
PL_B34_L16_N: J1001.42
PL_B34_L16_P: J1001.40
PL_B34_L17_N: J1001.48
PL_B34_L18_N: J1001.54
PL_B34_L18_P: J1001.46 J1001.52
PL_B34_L34_N: J1001.60
PL_B34_L34_P: J1001.58
PWR_EN: J1000.18

Not connected (* = marked no-connect by the designer): J1000 21* 23* 27* 29* 33* 35* 40* 42* 45* 47* 51* 53* 57* 59* 63* 65* 69* 71* 75* 77*; J1001 21* 22* 23* 24* 25* 28* 30* 34* 36* 39* 41* 63* 64* 65* 66* 69* 70 71* 72 75* 76* 77* 78

### Notes on the sheet
- [10] Mezzanine
- Title
- Size:
- Date:
- A3
- Number:
- Time:
- Revision:
- Sheet
- of
- File:
- (in symbol 10144518-082802LF) HEADER; Amphenol Bergstak Lite 0.8mm 80P

### Library data of the parts
J1000 J1001 = 10144518-082802LF: BergStak® Lite 0.80mm, Board-to-Board Connector, 80 Positions, Dual Row, Vertical Header; Manufacturer: Amphenol; Manufacturer Part Number: 10144518-082802LF